# Altium schematic sheet Tri_Btate_Bank.SchDoc
size 762 x 381 mm
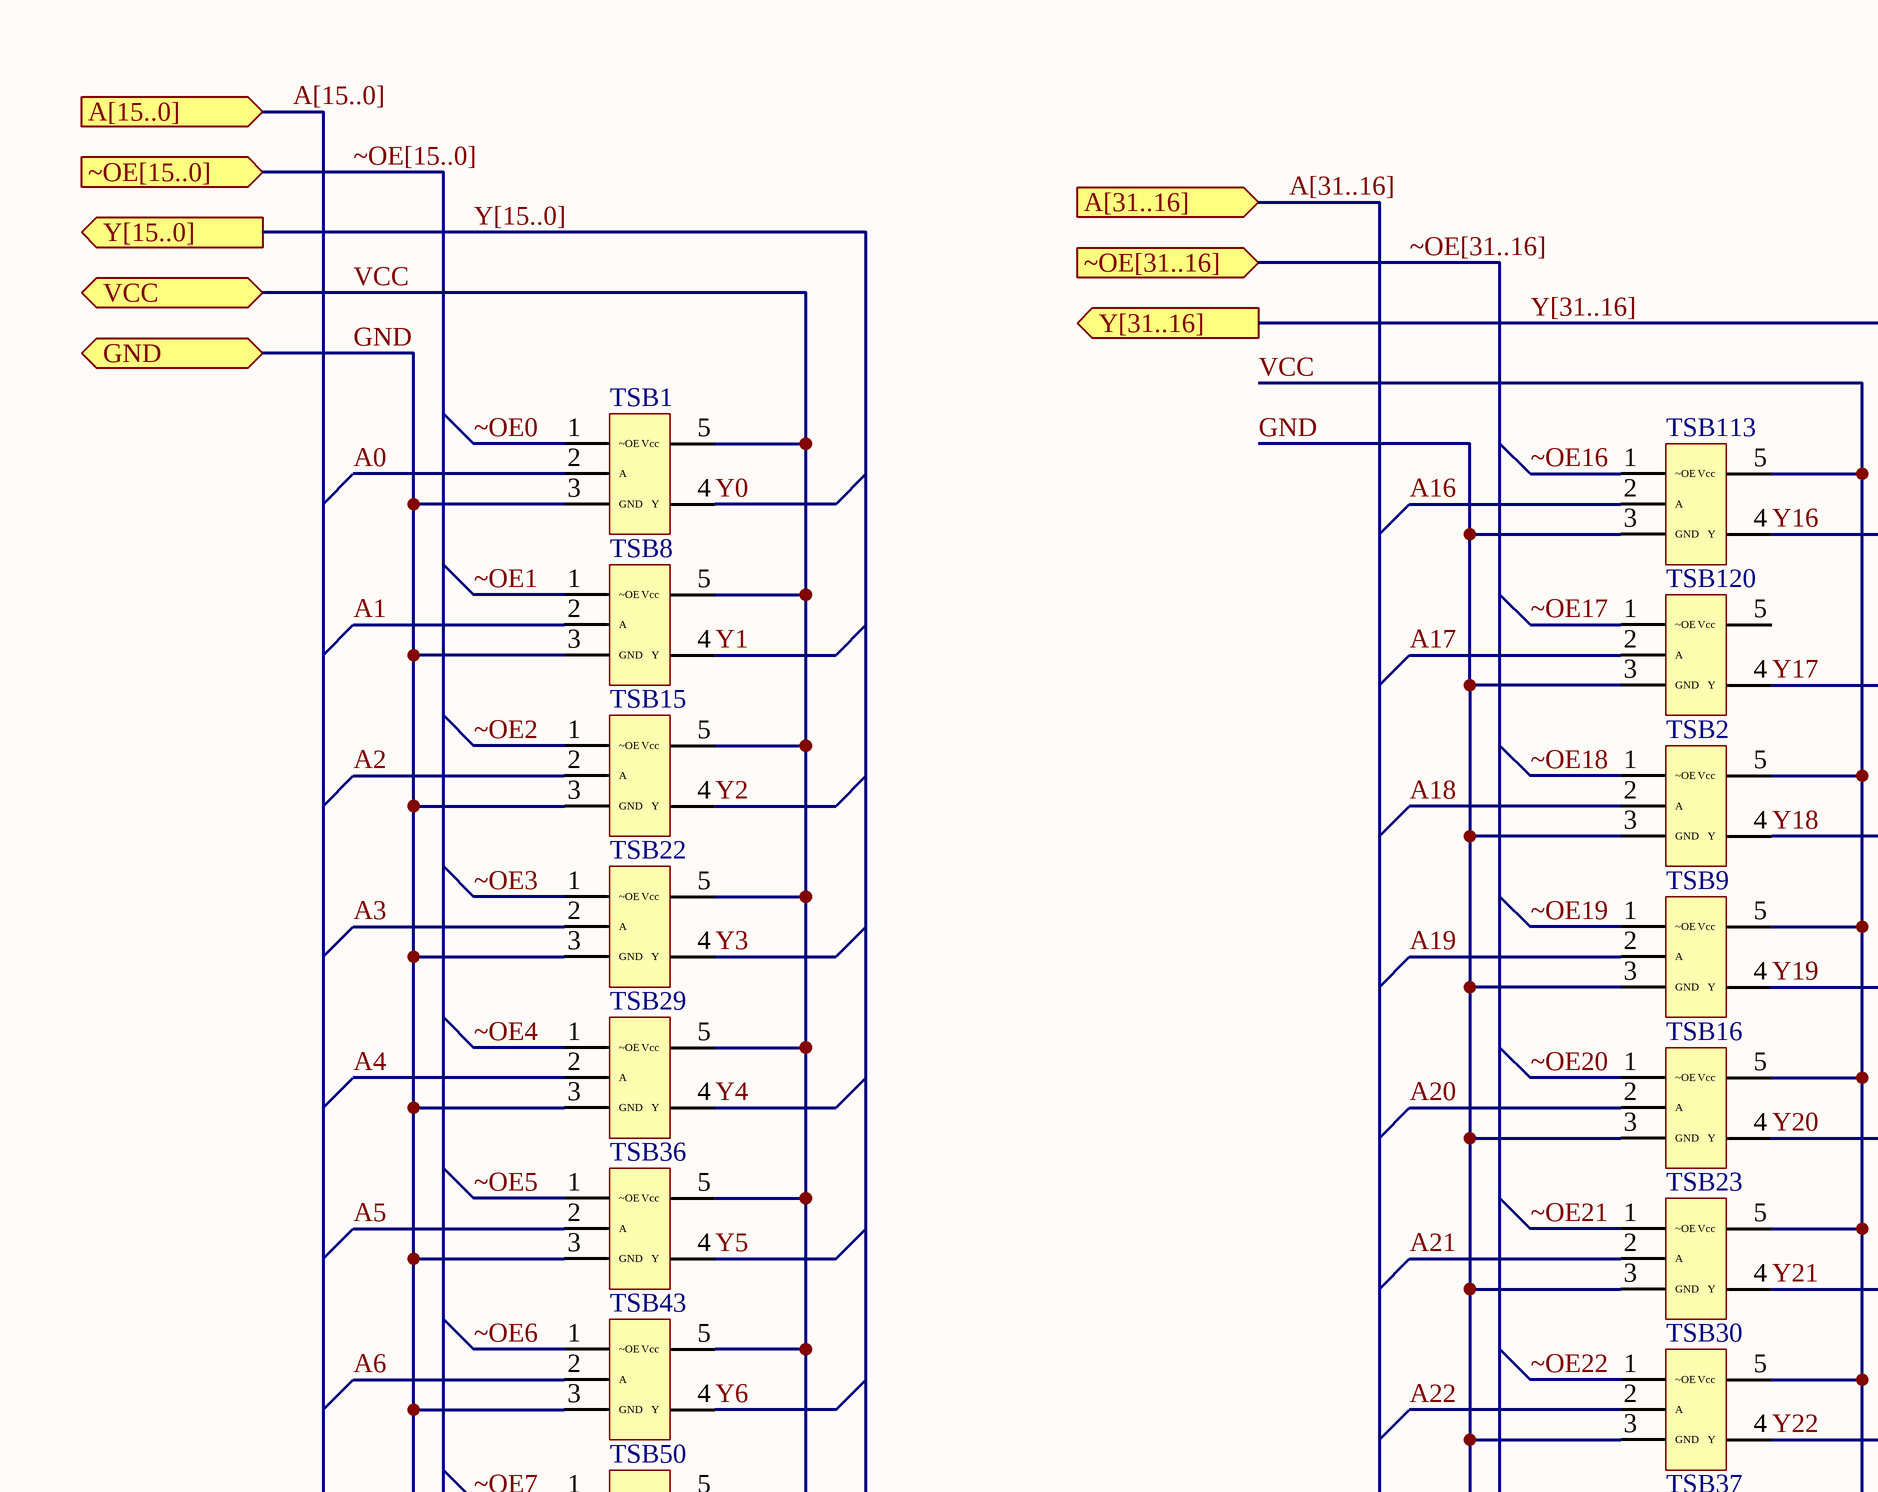
[diagram p0: Tri_Btate_Bank.SchDoc, top column 1 of 5]
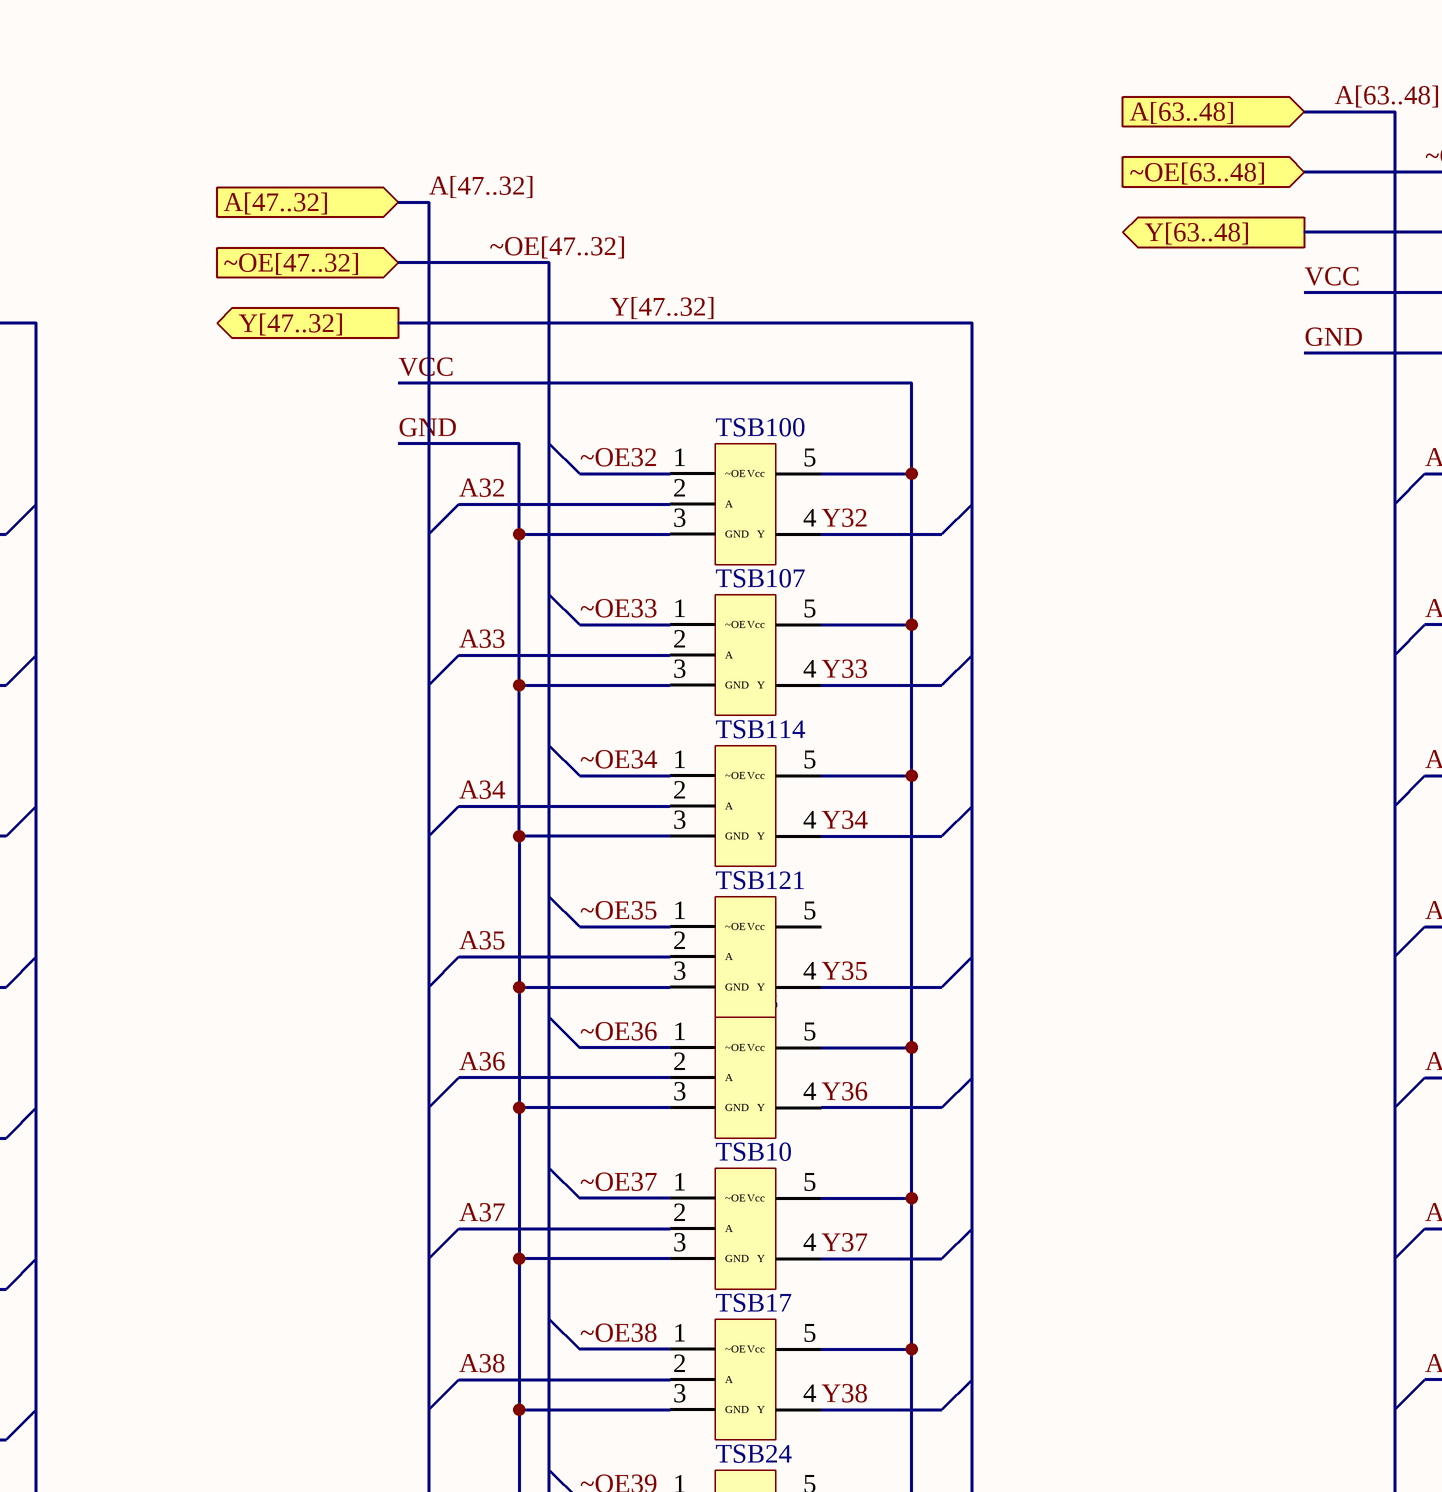
[diagram p1: Tri_Btate_Bank.SchDoc, top column 2 of 5]
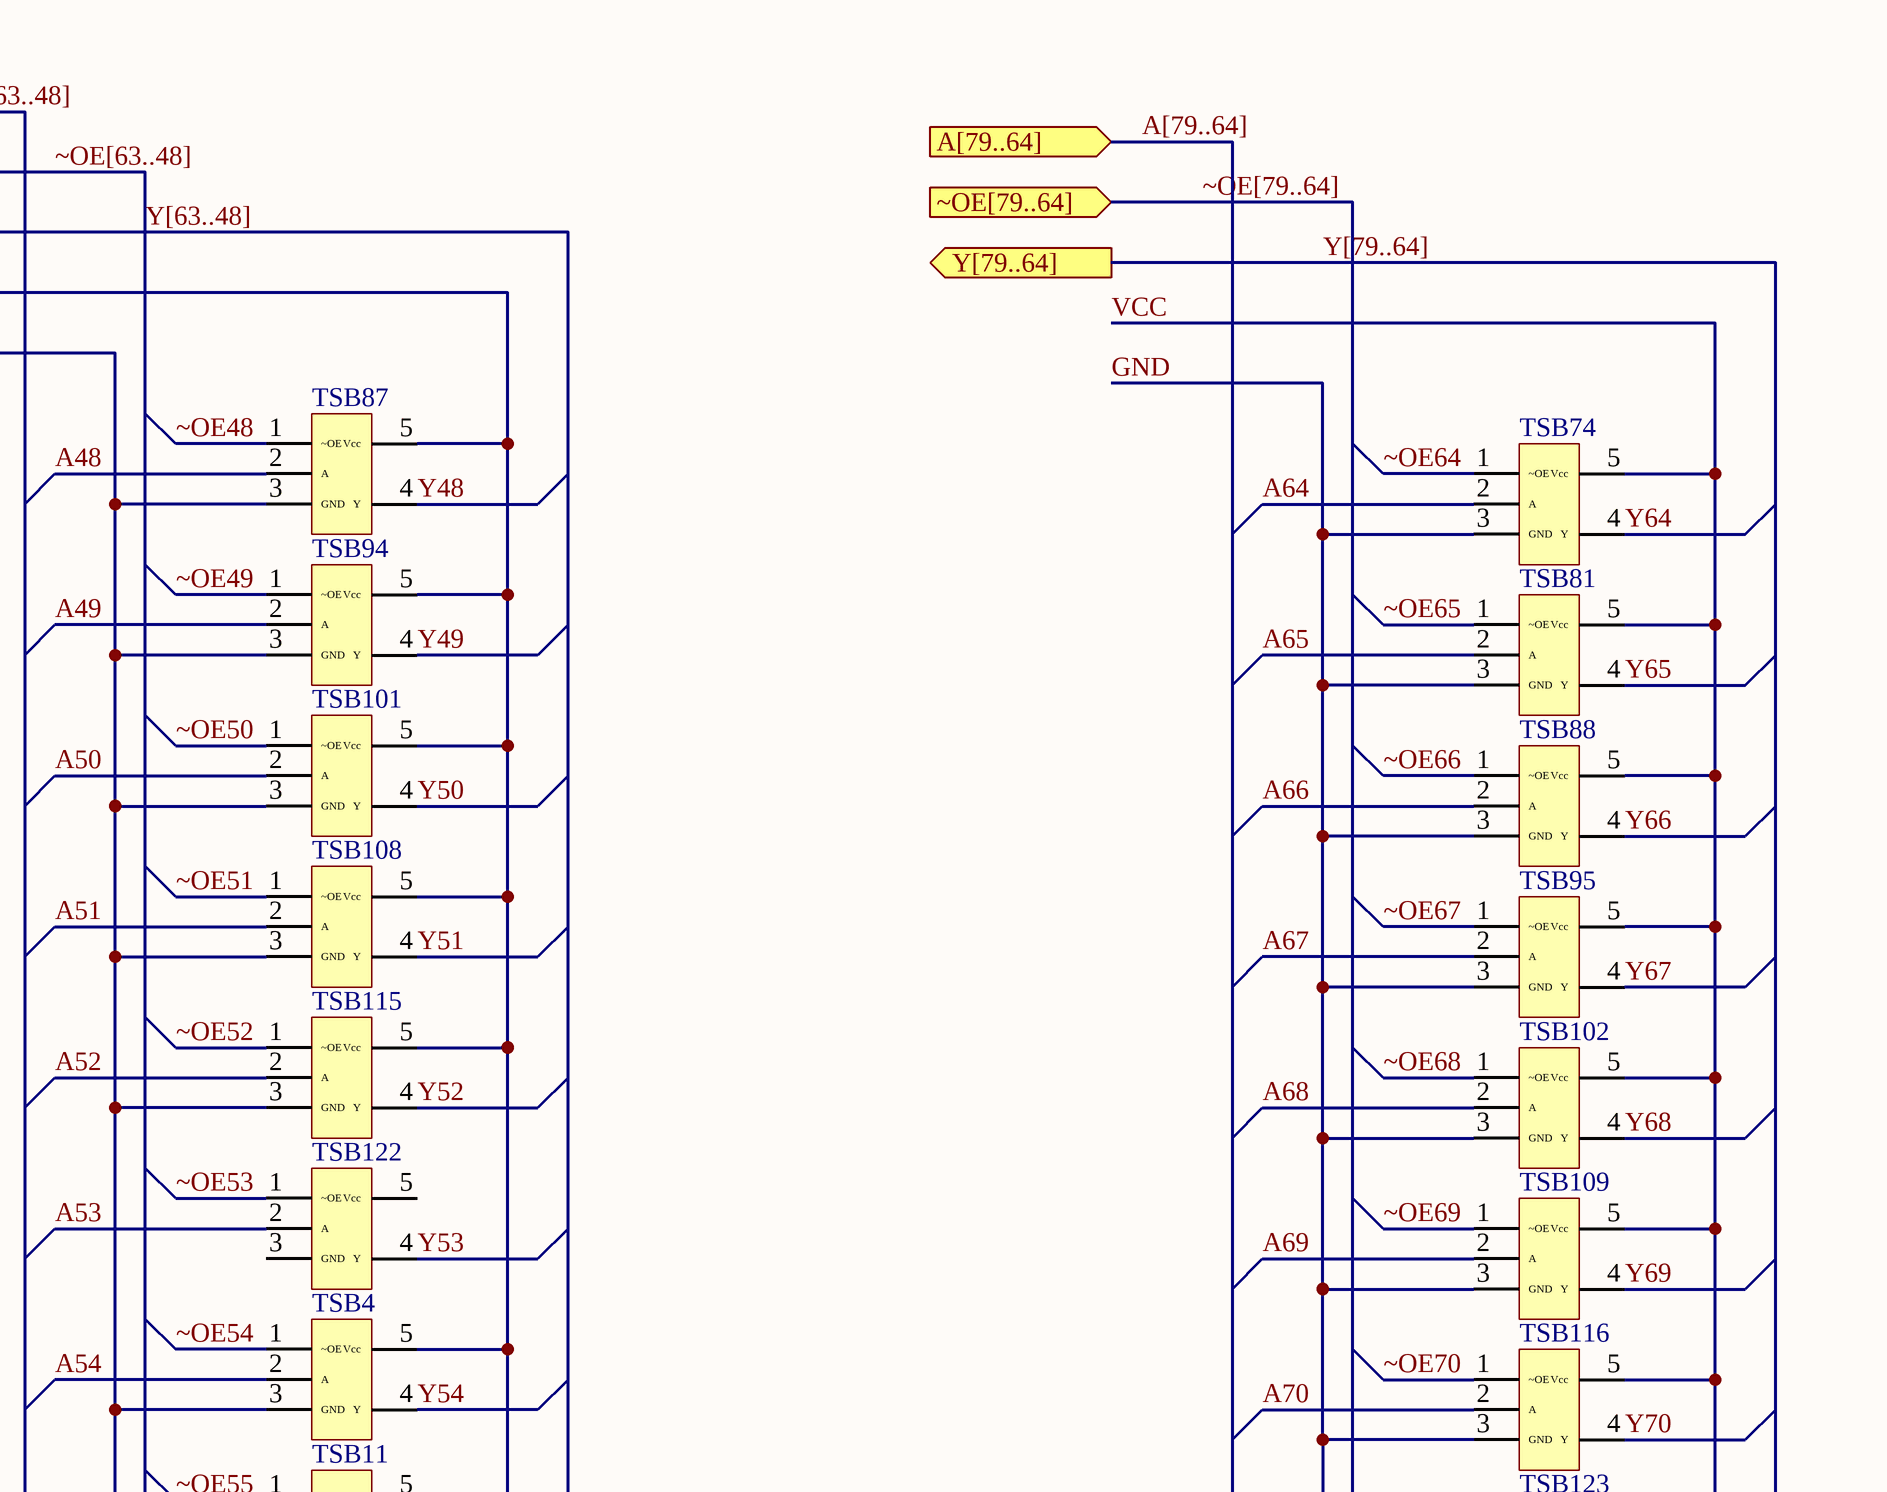
[diagram p2: Tri_Btate_Bank.SchDoc, top column 3 of 5]
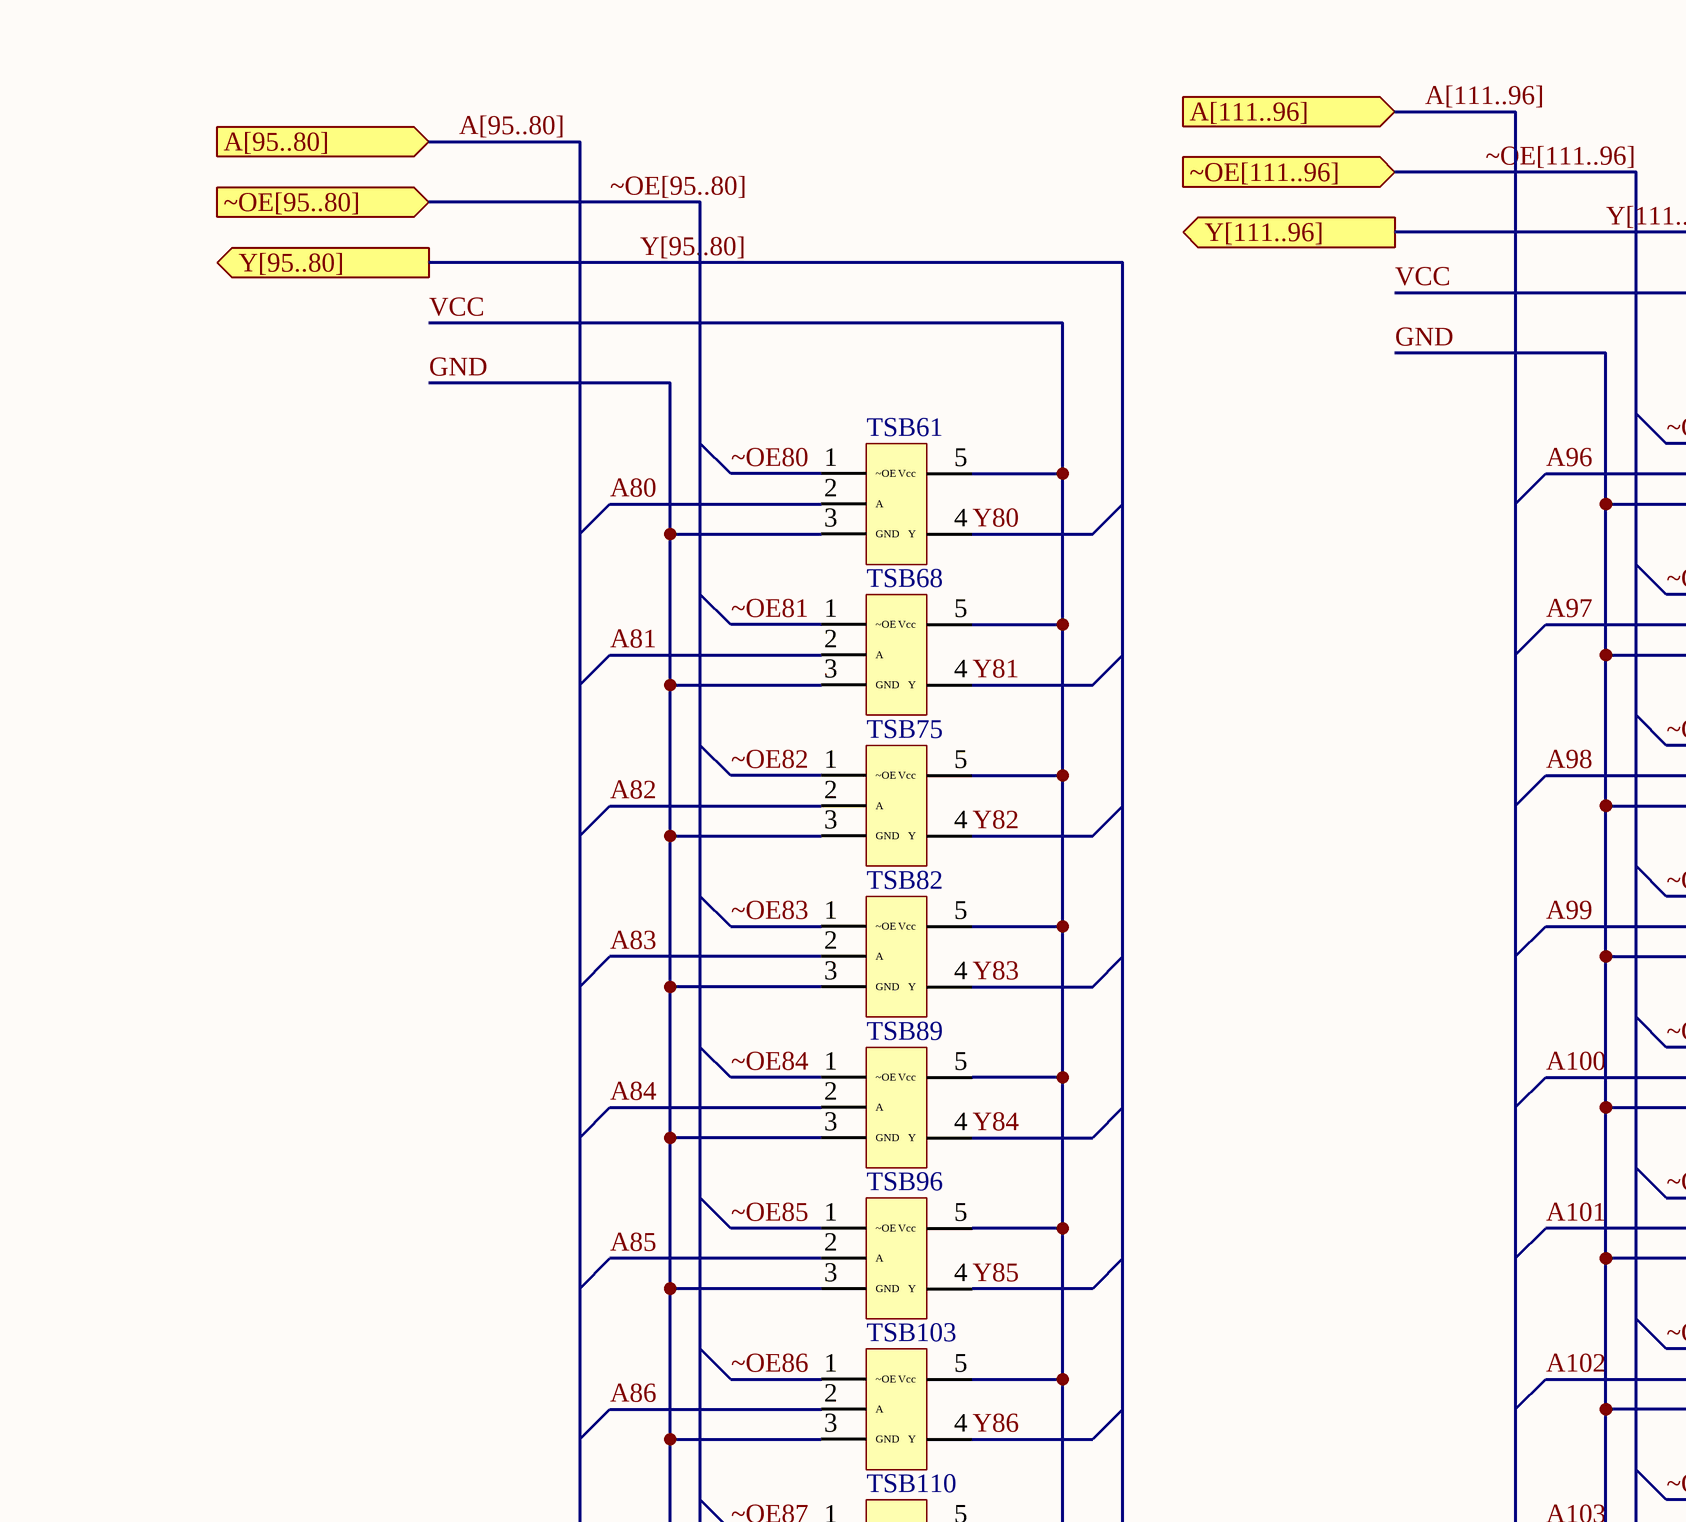
[diagram p3: Tri_Btate_Bank.SchDoc, top column 4 of 5]
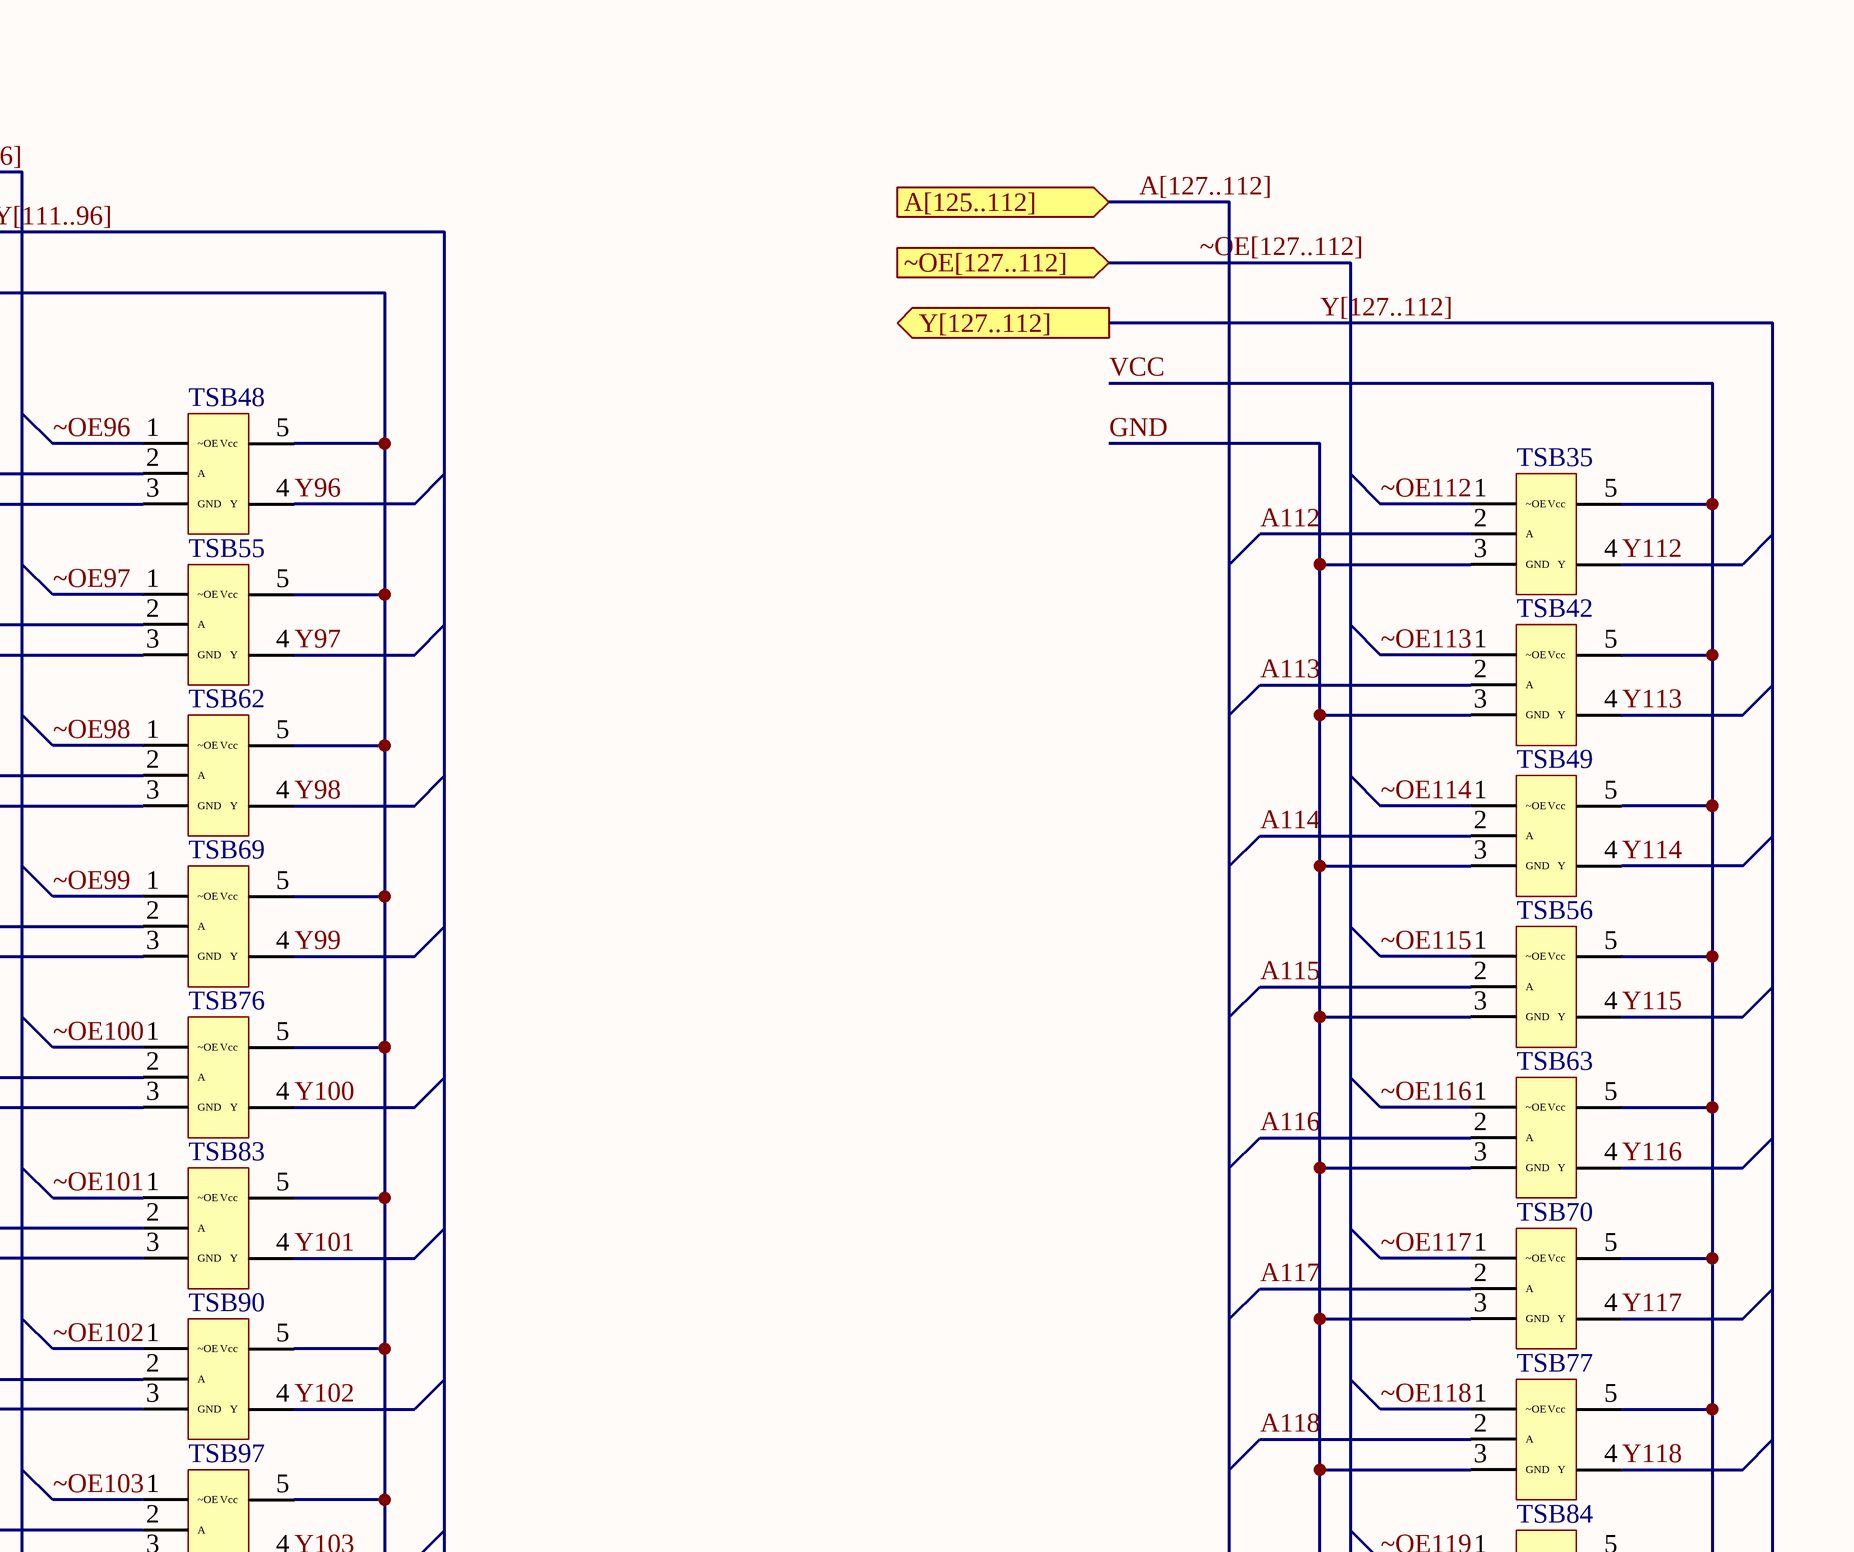
[diagram p4: Tri_Btate_Bank.SchDoc, top column 5 of 5]
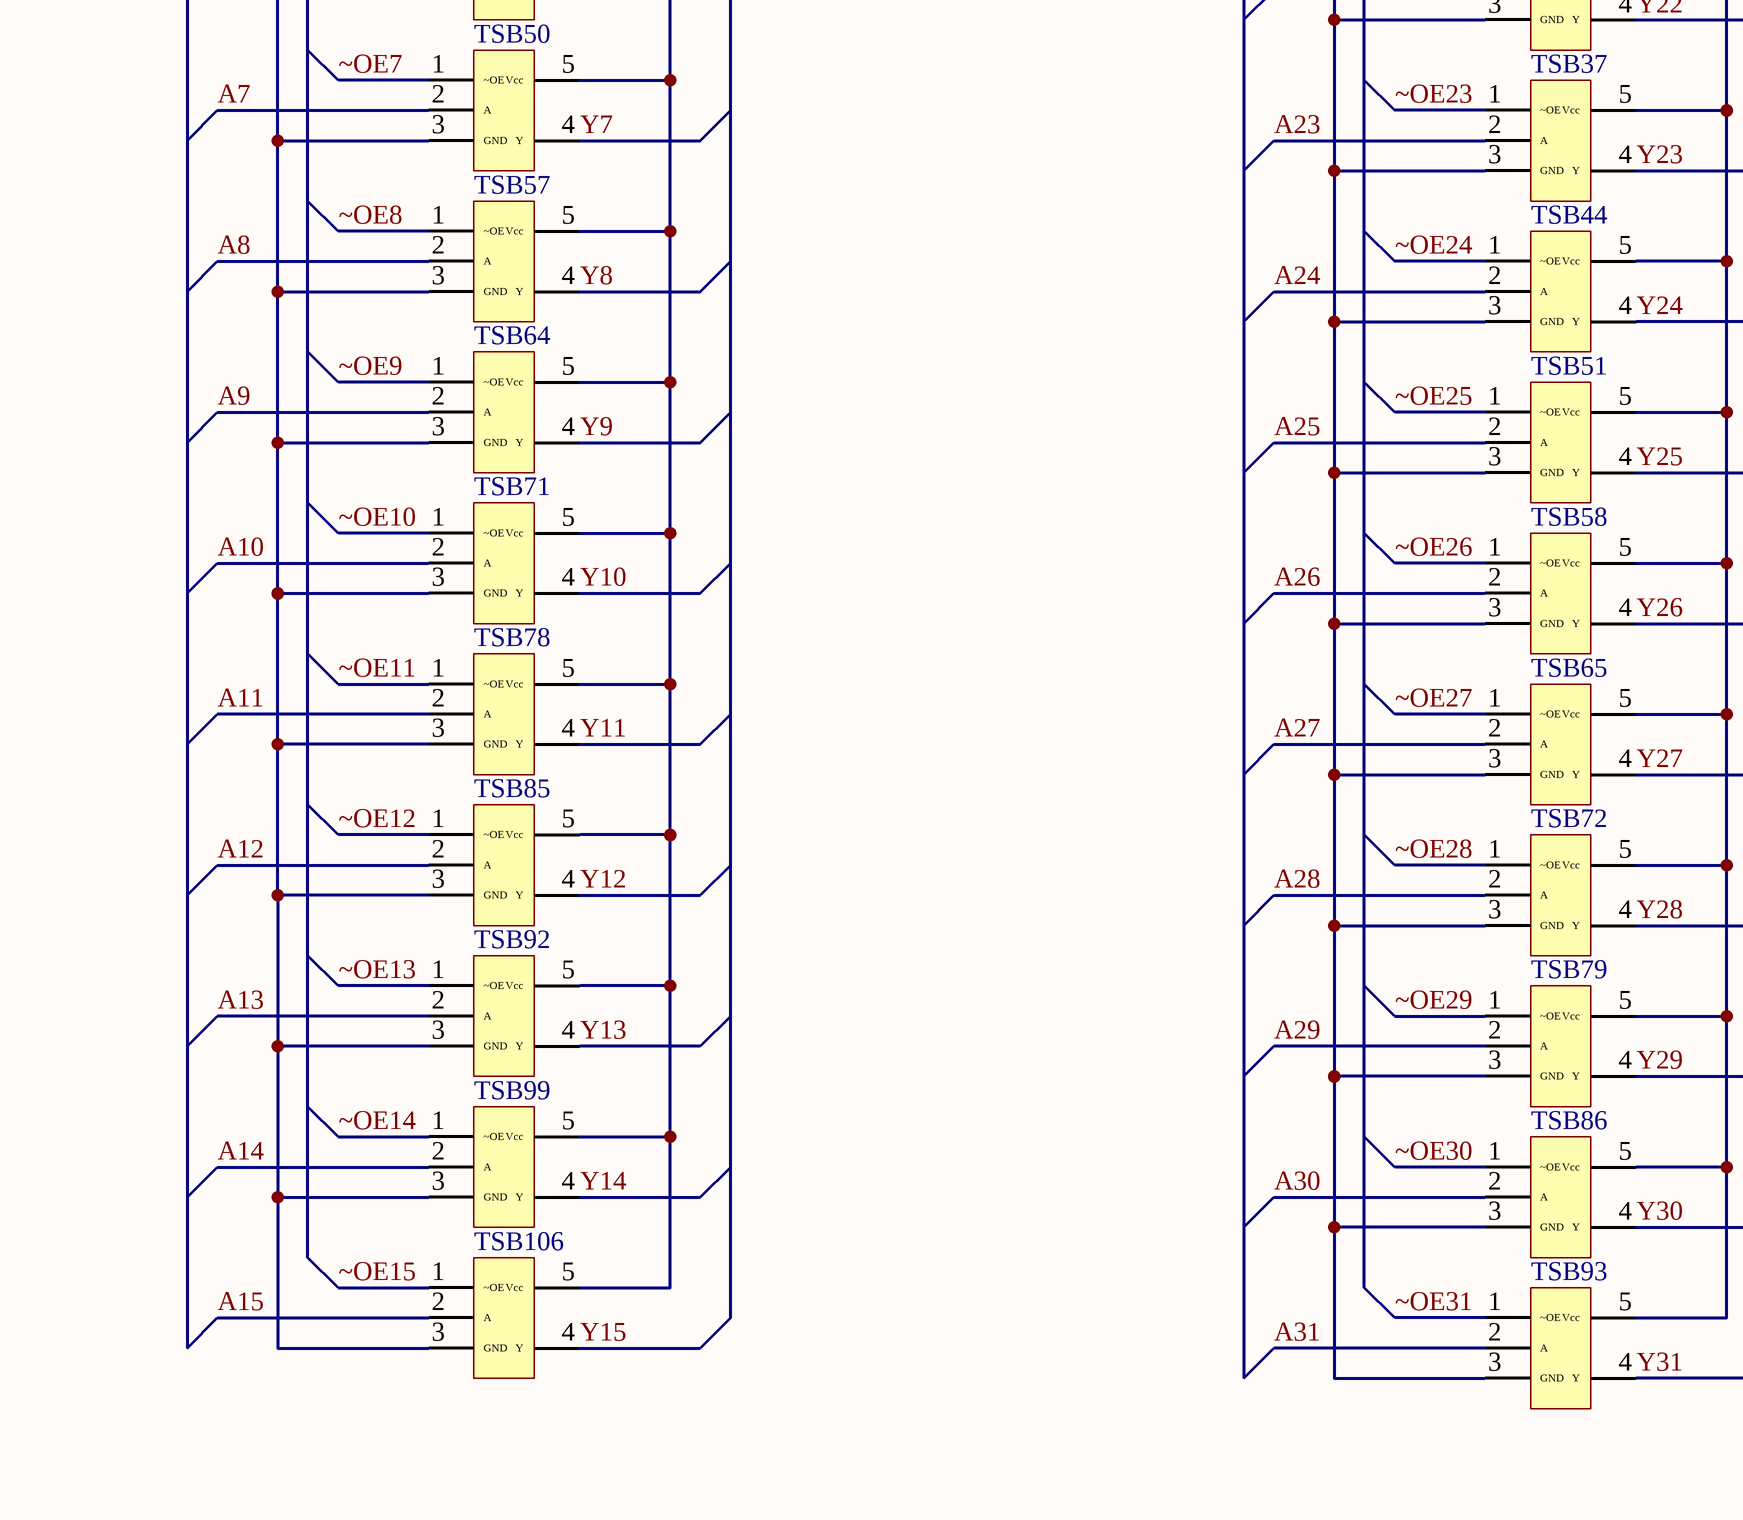
[diagram p5: Tri_Btate_Bank.SchDoc, bottom column 1 of 5]
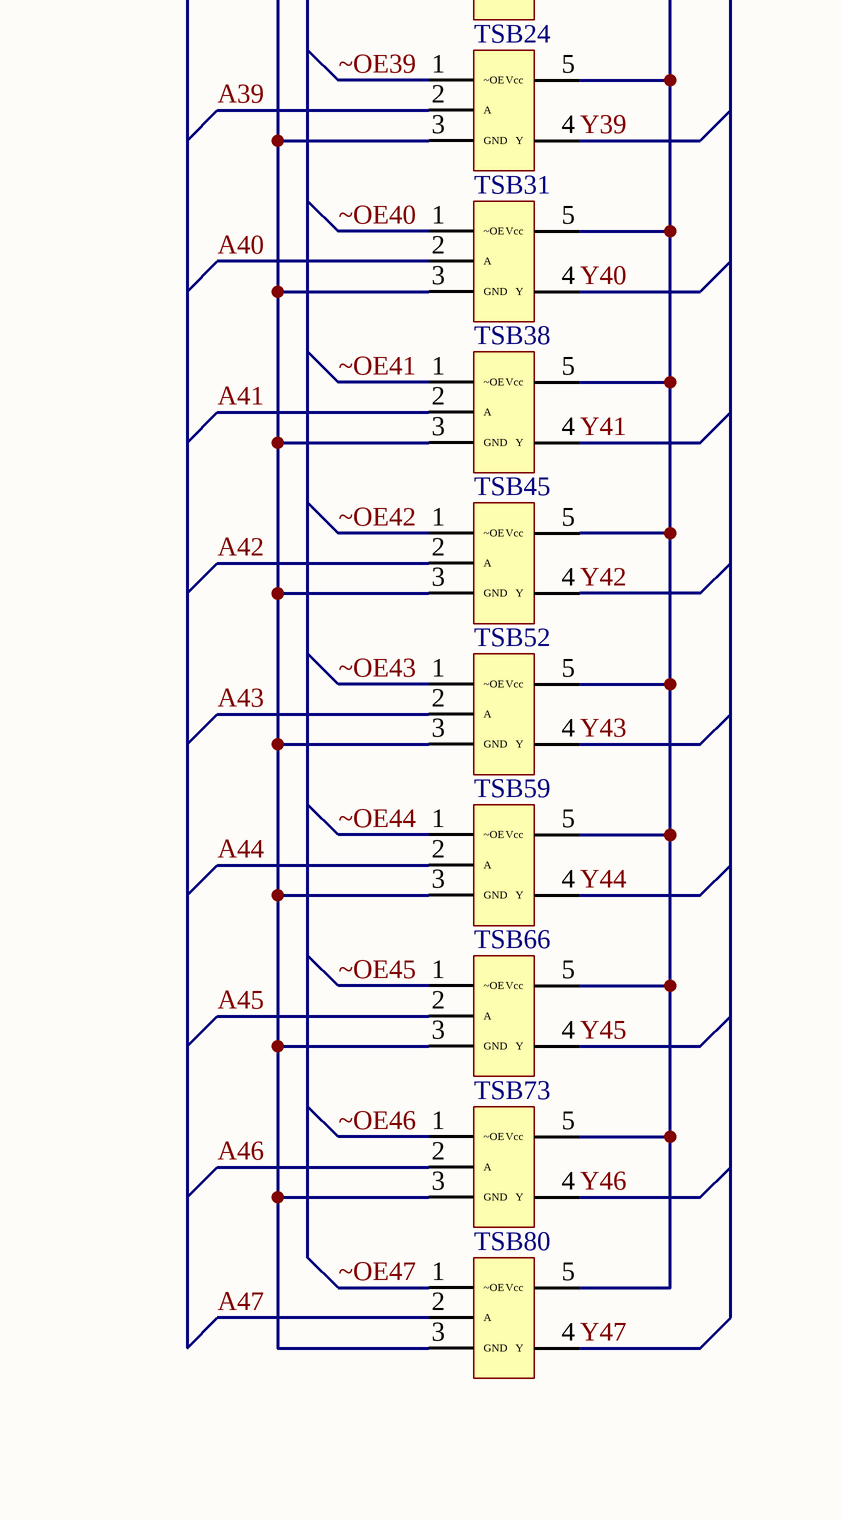
[diagram p6: Tri_Btate_Bank.SchDoc, bottom column 2 of 5]
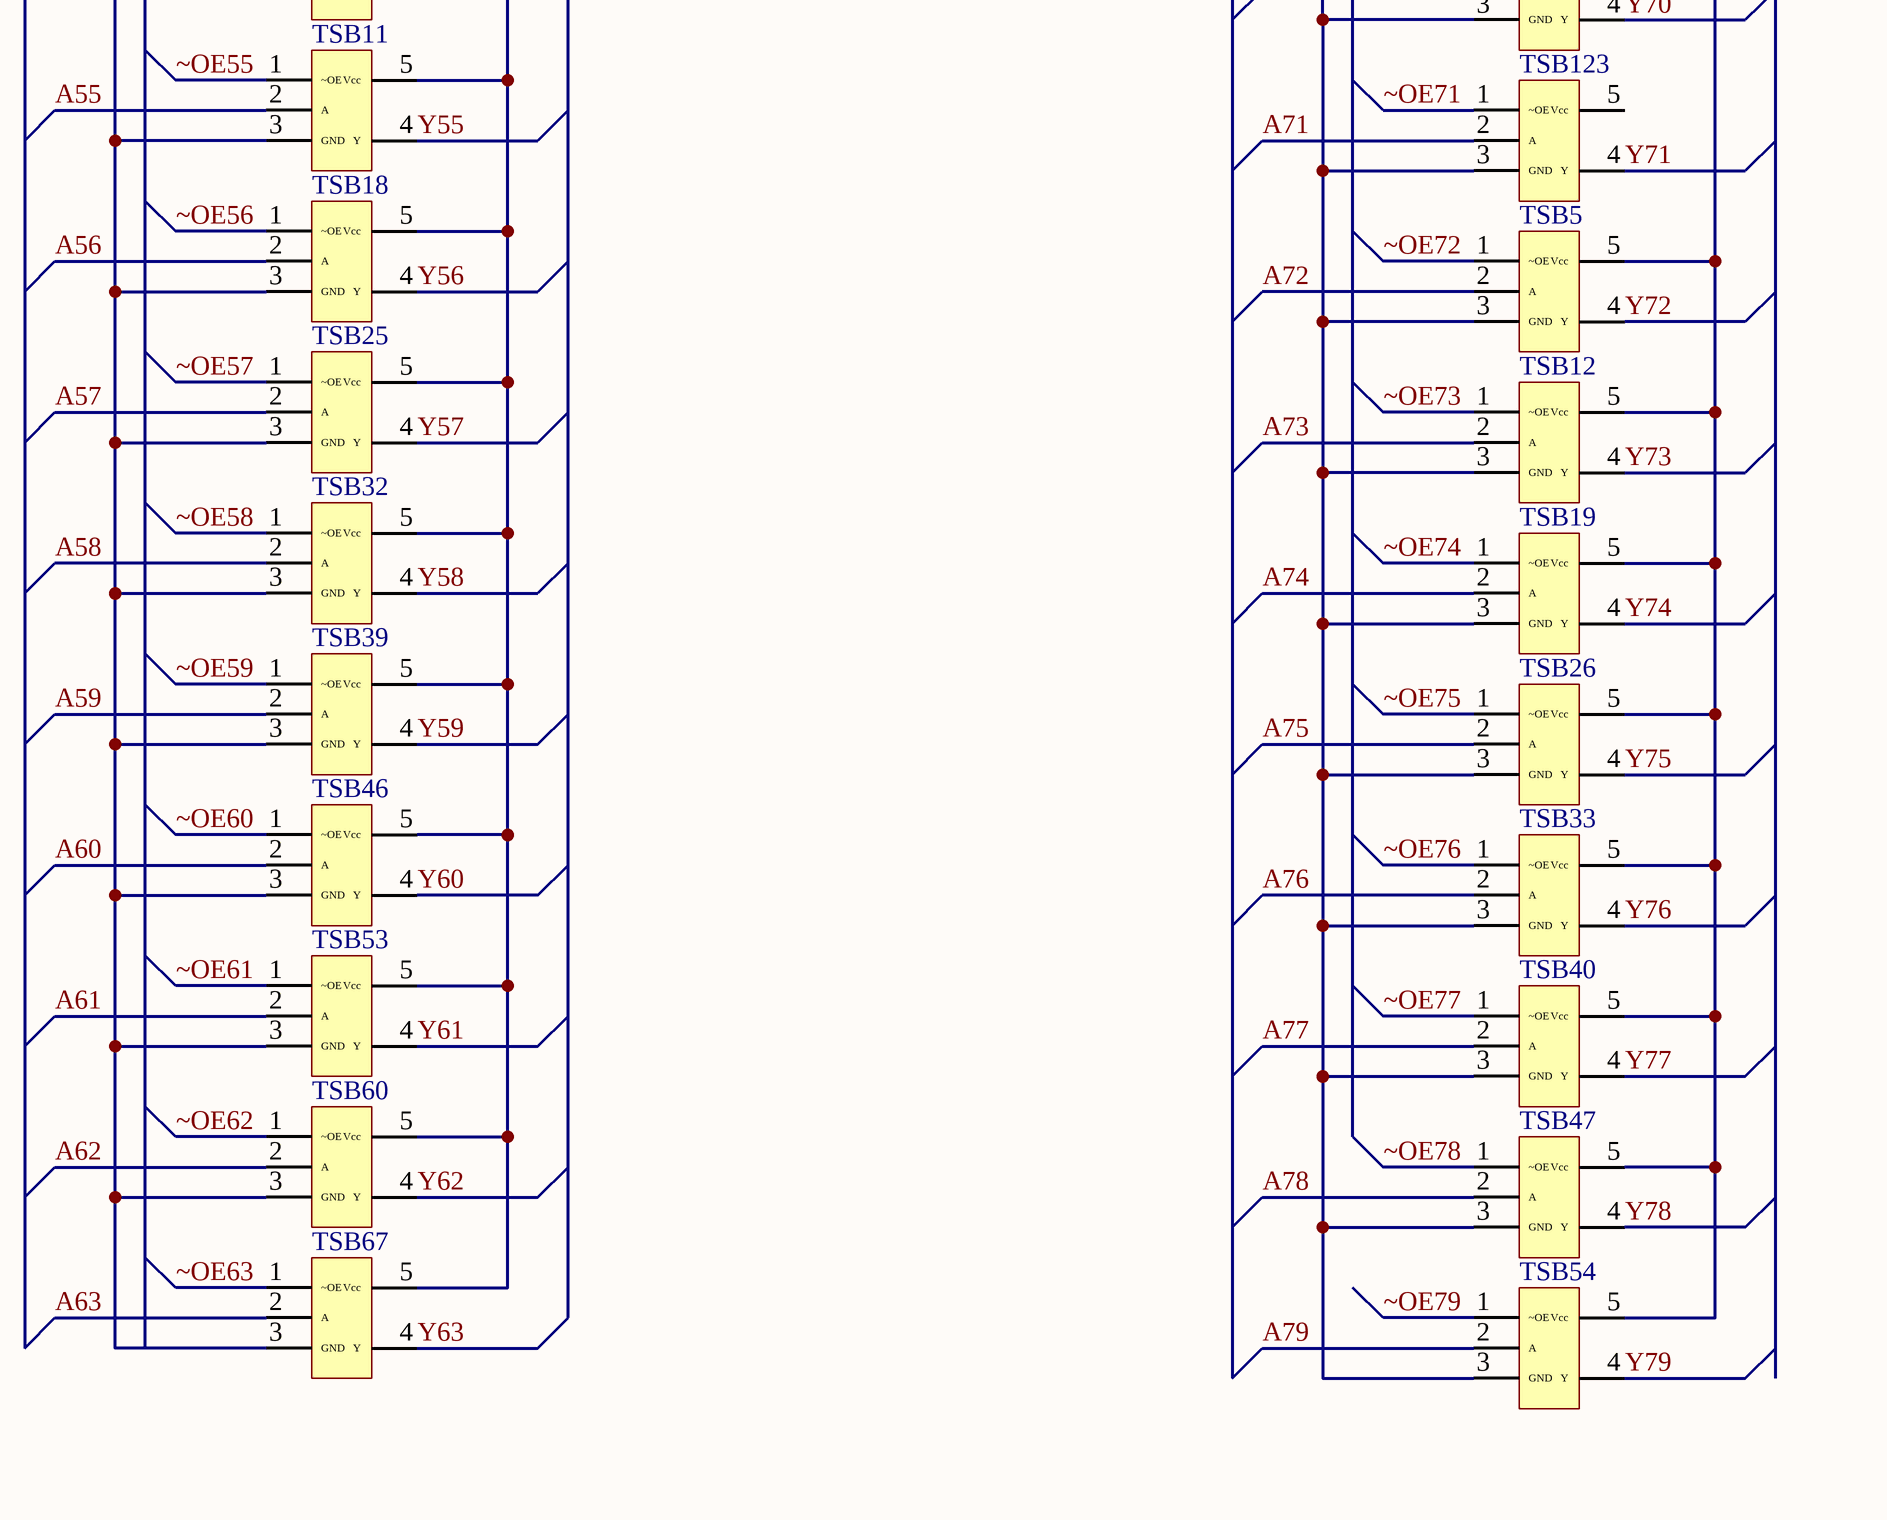
[diagram p7: Tri_Btate_Bank.SchDoc, bottom column 3 of 5]
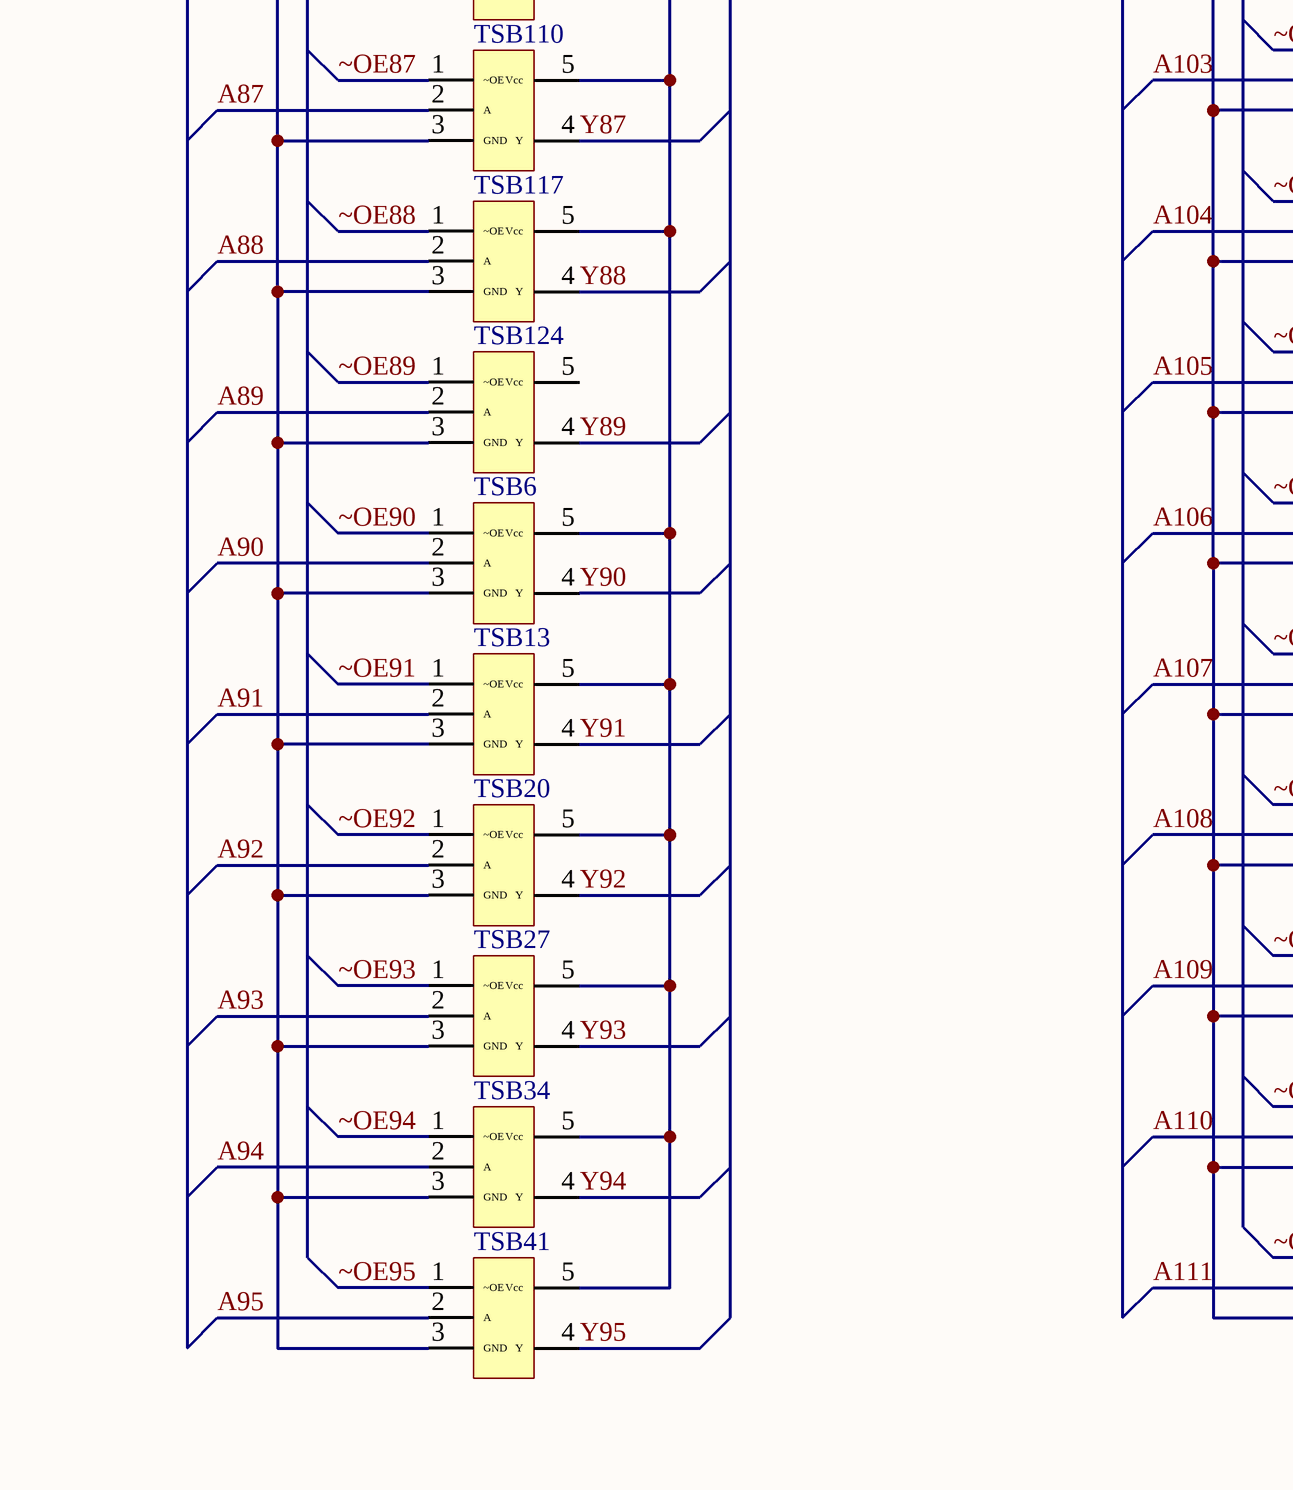
[diagram p8: Tri_Btate_Bank.SchDoc, bottom column 4 of 5]
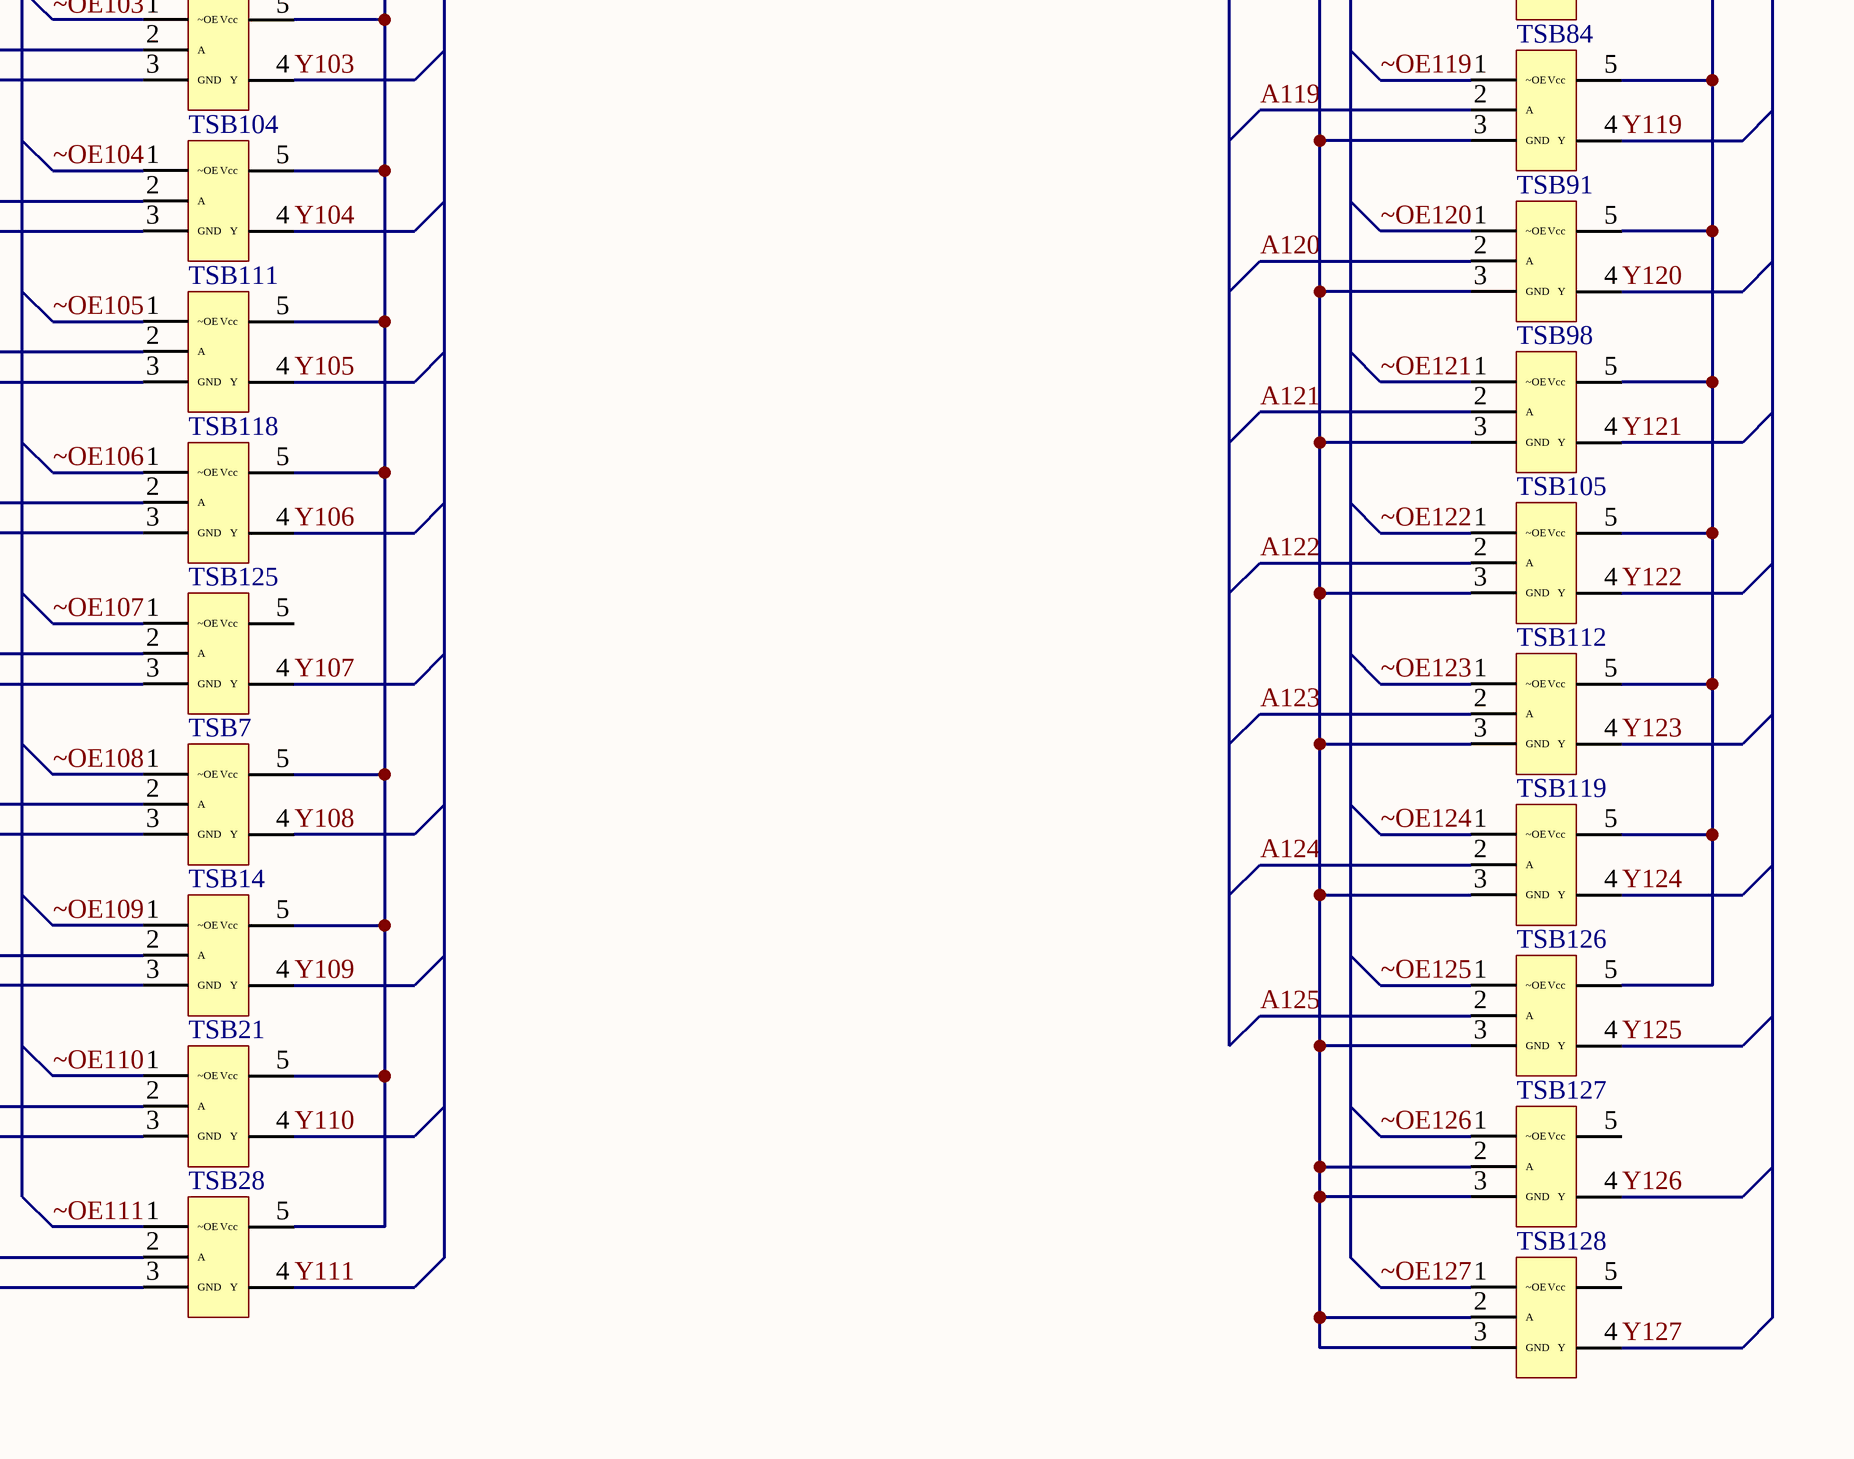
[diagram p9: Tri_Btate_Bank.SchDoc, bottom column 5 of 5]

## Parts
TSB1  Tri-State Buffer Non-Inverting  (value not drawn)
TSB2  Tri-State Buffer Non-Inverting  (value not drawn)
TSB3  Tri-State Buffer Non-Inverting  (value not drawn)
TSB4  Tri-State Buffer Non-Inverting  (value not drawn)
TSB5  Tri-State Buffer Non-Inverting  (value not drawn)
TSB6  Tri-State Buffer Non-Inverting  (value not drawn)
TSB7  Tri-State Buffer Non-Inverting  (value not drawn)
TSB8  Tri-State Buffer Non-Inverting  (value not drawn)
TSB9  Tri-State Buffer Non-Inverting  (value not drawn)
TSB10  Tri-State Buffer Non-Inverting  (value not drawn)
TSB11  Tri-State Buffer Non-Inverting  (value not drawn)
TSB12  Tri-State Buffer Non-Inverting  (value not drawn)
TSB13  Tri-State Buffer Non-Inverting  (value not drawn)
TSB14  Tri-State Buffer Non-Inverting  (value not drawn)
TSB15  Tri-State Buffer Non-Inverting  (value not drawn)
TSB16  Tri-State Buffer Non-Inverting  (value not drawn)
TSB17  Tri-State Buffer Non-Inverting  (value not drawn)
TSB18  Tri-State Buffer Non-Inverting  (value not drawn)
TSB19  Tri-State Buffer Non-Inverting  (value not drawn)
TSB20  Tri-State Buffer Non-Inverting  (value not drawn)
TSB21  Tri-State Buffer Non-Inverting  (value not drawn)
TSB22  Tri-State Buffer Non-Inverting  (value not drawn)
TSB23  Tri-State Buffer Non-Inverting  (value not drawn)
TSB24  Tri-State Buffer Non-Inverting  (value not drawn)
TSB25  Tri-State Buffer Non-Inverting  (value not drawn)
TSB26  Tri-State Buffer Non-Inverting  (value not drawn)
TSB27  Tri-State Buffer Non-Inverting  (value not drawn)
TSB28  Tri-State Buffer Non-Inverting  (value not drawn)
TSB29  Tri-State Buffer Non-Inverting  (value not drawn)
TSB30  Tri-State Buffer Non-Inverting  (value not drawn)
TSB31  Tri-State Buffer Non-Inverting  (value not drawn)
TSB32  Tri-State Buffer Non-Inverting  (value not drawn)
TSB33  Tri-State Buffer Non-Inverting  (value not drawn)
TSB34  Tri-State Buffer Non-Inverting  (value not drawn)
TSB35  Tri-State Buffer Non-Inverting  (value not drawn)
TSB36  Tri-State Buffer Non-Inverting  (value not drawn)
TSB37  Tri-State Buffer Non-Inverting  (value not drawn)
TSB38  Tri-State Buffer Non-Inverting  (value not drawn)
TSB39  Tri-State Buffer Non-Inverting  (value not drawn)
TSB40  Tri-State Buffer Non-Inverting  (value not drawn)
TSB41  Tri-State Buffer Non-Inverting  (value not drawn)
TSB42  Tri-State Buffer Non-Inverting  (value not drawn)
TSB43  Tri-State Buffer Non-Inverting  (value not drawn)
TSB44  Tri-State Buffer Non-Inverting  (value not drawn)
TSB45  Tri-State Buffer Non-Inverting  (value not drawn)
TSB46  Tri-State Buffer Non-Inverting  (value not drawn)
TSB47  Tri-State Buffer Non-Inverting  (value not drawn)
TSB48  Tri-State Buffer Non-Inverting  (value not drawn)
TSB49  Tri-State Buffer Non-Inverting  (value not drawn)
TSB50  Tri-State Buffer Non-Inverting  (value not drawn)
TSB51  Tri-State Buffer Non-Inverting  (value not drawn)
TSB52  Tri-State Buffer Non-Inverting  (value not drawn)
TSB53  Tri-State Buffer Non-Inverting  (value not drawn)
TSB54  Tri-State Buffer Non-Inverting  (value not drawn)
TSB55  Tri-State Buffer Non-Inverting  (value not drawn)
TSB56  Tri-State Buffer Non-Inverting  (value not drawn)
TSB57  Tri-State Buffer Non-Inverting  (value not drawn)
TSB58  Tri-State Buffer Non-Inverting  (value not drawn)
TSB59  Tri-State Buffer Non-Inverting  (value not drawn)
TSB60  Tri-State Buffer Non-Inverting  (value not drawn)
TSB61  Tri-State Buffer Non-Inverting  (value not drawn)
TSB62  Tri-State Buffer Non-Inverting  (value not drawn)
TSB63  Tri-State Buffer Non-Inverting  (value not drawn)
TSB64  Tri-State Buffer Non-Inverting  (value not drawn)
TSB65  Tri-State Buffer Non-Inverting  (value not drawn)
TSB66  Tri-State Buffer Non-Inverting  (value not drawn)
TSB67  Tri-State Buffer Non-Inverting  (value not drawn)
TSB68  Tri-State Buffer Non-Inverting  (value not drawn)
TSB69  Tri-State Buffer Non-Inverting  (value not drawn)
TSB70  Tri-State Buffer Non-Inverting  (value not drawn)
TSB71  Tri-State Buffer Non-Inverting  (value not drawn)
TSB72  Tri-State Buffer Non-Inverting  (value not drawn)
TSB73  Tri-State Buffer Non-Inverting  (value not drawn)
TSB74  Tri-State Buffer Non-Inverting  (value not drawn)
TSB75  Tri-State Buffer Non-Inverting  (value not drawn)
TSB76  Tri-State Buffer Non-Inverting  (value not drawn)
TSB77  Tri-State Buffer Non-Inverting  (value not drawn)
TSB78  Tri-State Buffer Non-Inverting  (value not drawn)
TSB79  Tri-State Buffer Non-Inverting  (value not drawn)
TSB80  Tri-State Buffer Non-Inverting  (value not drawn)
TSB81  Tri-State Buffer Non-Inverting  (value not drawn)
TSB82  Tri-State Buffer Non-Inverting  (value not drawn)
TSB83  Tri-State Buffer Non-Inverting  (value not drawn)
TSB84  Tri-State Buffer Non-Inverting  (value not drawn)
TSB85  Tri-State Buffer Non-Inverting  (value not drawn)
TSB86  Tri-State Buffer Non-Inverting  (value not drawn)
TSB87  Tri-State Buffer Non-Inverting  (value not drawn)
TSB88  Tri-State Buffer Non-Inverting  (value not drawn)
TSB89  Tri-State Buffer Non-Inverting  (value not drawn)
TSB90  Tri-State Buffer Non-Inverting  (value not drawn)
TSB91  Tri-State Buffer Non-Inverting  (value not drawn)
TSB92  Tri-State Buffer Non-Inverting  (value not drawn)
TSB93  Tri-State Buffer Non-Inverting  (value not drawn)
TSB94  Tri-State Buffer Non-Inverting  (value not drawn)
TSB95  Tri-State Buffer Non-Inverting  (value not drawn)
TSB96  Tri-State Buffer Non-Inverting  (value not drawn)
TSB97  Tri-State Buffer Non-Inverting  (value not drawn)
TSB98  Tri-State Buffer Non-Inverting  (value not drawn)
TSB99  Tri-State Buffer Non-Inverting  (value not drawn)
TSB100  Tri-State Buffer Non-Inverting  (value not drawn)
TSB101  Tri-State Buffer Non-Inverting  (value not drawn)
TSB102  Tri-State Buffer Non-Inverting  (value not drawn)
TSB103  Tri-State Buffer Non-Inverting  (value not drawn)
TSB104  Tri-State Buffer Non-Inverting  (value not drawn)
TSB105  Tri-State Buffer Non-Inverting  (value not drawn)
TSB106  Tri-State Buffer Non-Inverting  (value not drawn)
TSB107  Tri-State Buffer Non-Inverting  (value not drawn)
TSB108  Tri-State Buffer Non-Inverting  (value not drawn)
TSB109  Tri-State Buffer Non-Inverting  (value not drawn)
TSB110  Tri-State Buffer Non-Inverting  (value not drawn)
TSB111  Tri-State Buffer Non-Inverting  (value not drawn)
TSB112  Tri-State Buffer Non-Inverting  (value not drawn)
TSB113  Tri-State Buffer Non-Inverting  (value not drawn)
TSB114  Tri-State Buffer Non-Inverting  (value not drawn)
TSB115  Tri-State Buffer Non-Inverting  (value not drawn)
TSB116  Tri-State Buffer Non-Inverting  (value not drawn)
TSB117  Tri-State Buffer Non-Inverting  (value not drawn)
TSB118  Tri-State Buffer Non-Inverting  (value not drawn)
TSB119  Tri-State Buffer Non-Inverting  (value not drawn)
TSB120  Tri-State Buffer Non-Inverting  (value not drawn)
TSB121  Tri-State Buffer Non-Inverting  (value not drawn)
TSB122  Tri-State Buffer Non-Inverting  (value not drawn)
TSB123  Tri-State Buffer Non-Inverting  (value not drawn)
TSB124  Tri-State Buffer Non-Inverting  (value not drawn)
TSB125  Tri-State Buffer Non-Inverting  (value not drawn)
TSB126  Tri-State Buffer Non-Inverting  (value not drawn)
TSB127  Tri-State Buffer Non-Inverting  (value not drawn)
TSB128  Tri-State Buffer Non-Inverting  (value not drawn)

## Ports
A[15..0] (in), A[31..16] (in), A[47..32] (in), A[63..48] (in), A[79..64] (in), A[95..80] (in), A[111..96] (in), A[125..112] (in), GND (bidir), VCC (bidir), Y[15..0] (out), Y[31..16] (out), Y[47..32] (out), Y[63..48] (out), Y[79..64] (out), Y[95..80] (out), Y[111..96] (out), Y[127..112] (out), ~OE[15..0] (in), ~OE[31..16] (in), ~OE[47..32] (in), ~OE[63..48] (in), ~OE[79..64] (in), ~OE[95..80] (in), ~OE[111..96] (in), ~OE[127..112] (in)

## Nets
A0: TSB1.2(A)
A1: TSB8.2(A)
A2: TSB15.2(A)
A3: TSB22.2(A)
A4: TSB29.2(A)
A5: TSB36.2(A)
A6: TSB43.2(A)
A7: TSB50.2(A)
A8: TSB57.2(A)
A9: TSB64.2(A)
A10: TSB71.2(A)
A11: TSB78.2(A)
A12: TSB85.2(A)
A13: TSB92.2(A)
A14: TSB99.2(A)
A15: TSB106.2(A)
A16: TSB113.2(A)
A17: TSB120.2(A)
A18: TSB2.2(A)
A19: TSB9.2(A)
A20: TSB16.2(A)
A21: TSB23.2(A)
A22: TSB30.2(A)
A23: TSB37.2(A)
A24: TSB44.2(A)
A25: TSB51.2(A)
A26: TSB58.2(A)
A27: TSB65.2(A)
A28: TSB72.2(A)
A29: TSB79.2(A)
A30: TSB86.2(A)
A31: TSB93.2(A)
A32: TSB100.2(A)
A33: TSB107.2(A)
A34: TSB114.2(A)
A35: TSB121.2(A)
A36: TSB3.2(A)
A37: TSB10.2(A)
A38: TSB17.2(A)
A39: TSB24.2(A)
A40: TSB31.2(A)
A41: TSB38.2(A)
A42: TSB45.2(A)
A43: TSB52.2(A)
A44: TSB59.2(A)
A45: TSB66.2(A)
A46: TSB73.2(A)
A47: TSB80.2(A)
A48: TSB87.2(A)
A49: TSB94.2(A)
A50: TSB101.2(A)
A51: TSB108.2(A)
A52: TSB115.2(A)
A53: TSB122.2(A)
A54: TSB4.2(A)
A55: TSB11.2(A)
A56: TSB18.2(A)
A57: TSB25.2(A)
A58: TSB32.2(A)
A59: TSB39.2(A)
A60: TSB46.2(A)
A61: TSB53.2(A)
A62: TSB60.2(A)
A63: TSB67.2(A)
A64: TSB74.2(A)
A65: TSB81.2(A)
A66: TSB88.2(A)
A67: TSB95.2(A)
A68: TSB102.2(A)
A69: TSB109.2(A)
A70: TSB116.2(A)
A71: TSB123.2(A)
A72: TSB5.2(A)
A73: TSB12.2(A)
A74: TSB19.2(A)
A75: TSB26.2(A)
A76: TSB33.2(A)
A77: TSB40.2(A)
A78: TSB47.2(A)
A79: TSB54.2(A)
A80: TSB61.2(A)
A81: TSB68.2(A)
A82: TSB75.2(A)
A83: TSB82.2(A)
A84: TSB89.2(A)
A85: TSB96.2(A)
A86: TSB103.2(A)
A87: TSB110.2(A)
A88: TSB117.2(A)
A89: TSB124.2(A)
A90: TSB6.2(A)
A91: TSB13.2(A)
A92: TSB20.2(A)
A93: TSB27.2(A)
A94: TSB34.2(A)
A95: TSB41.2(A)
A96: TSB48.2(A)
A97: TSB55.2(A)
A98: TSB62.2(A)
A99: TSB69.2(A)
A100: TSB76.2(A)
A101: TSB83.2(A)
A102: TSB90.2(A)
A103: TSB97.2(A)
A104: TSB104.2(A)
A105: TSB111.2(A)
A106: TSB118.2(A)
A107: TSB125.2(A)
A108: TSB7.2(A)
A109: TSB14.2(A)
A110: TSB21.2(A)
A111: TSB28.2(A)
A112: TSB35.2(A)
A113: TSB42.2(A)
A114: TSB49.2(A)
A115: TSB56.2(A)
A116: TSB63.2(A)
A117: TSB70.2(A)
A118: TSB77.2(A)
A119: TSB84.2(A)
A120: TSB91.2(A)
A121: TSB98.2(A)
A122: TSB105.2(A)
A123: TSB112.2(A)
A124: TSB119.2(A)
A125: TSB126.2(A)
GND: TSB1.3(GND) TSB2.3(GND) TSB3.3(GND) TSB4.3(GND) TSB5.3(GND) TSB6.3(GND) TSB7.3(GND) TSB8.3(GND) TSB9.3(GND) TSB10.3(GND) TSB11.3(GND) TSB12.3(GND) TSB13.3(GND) TSB14.3(GND) TSB15.3(GND) TSB16.3(GND) TSB17.3(GND) TSB18.3(GND) TSB19.3(GND) TSB20.3(GND) TSB21.3(GND) TSB22.3(GND) TSB23.3(GND) TSB24.3(GND) TSB25.3(GND) TSB26.3(GND) TSB27.3(GND) TSB28.3(GND) TSB29.3(GND) TSB30.3(GND) TSB31.3(GND) TSB32.3(GND) TSB33.3(GND) TSB34.3(GND) TSB35.3(GND) TSB36.3(GND) TSB37.3(GND) TSB38.3(GND) TSB39.3(GND) TSB40.3(GND) TSB41.3(GND) TSB42.3(GND) TSB43.3(GND) TSB44.3(GND) TSB45.3(GND) TSB46.3(GND) TSB47.3(GND) TSB48.3(GND) TSB49.3(GND) TSB50.3(GND) TSB51.3(GND) TSB52.3(GND) TSB53.3(GND) TSB54.3(GND) TSB55.3(GND) TSB56.3(GND) TSB57.3(GND) TSB58.3(GND) TSB59.3(GND) TSB60.3(GND) TSB61.3(GND) TSB62.3(GND) TSB63.3(GND) TSB64.3(GND) TSB65.3(GND) TSB66.3(GND) TSB67.3(GND) TSB68.3(GND) TSB69.3(GND) TSB70.3(GND) TSB71.3(GND) TSB72.3(GND) TSB73.3(GND) TSB74.3(GND) TSB75.3(GND) TSB76.3(GND) TSB77.3(GND) TSB78.3(GND) TSB79.3(GND) TSB80.3(GND) TSB81.3(GND) TSB82.3(GND) TSB83.3(GND) TSB84.3(GND) TSB85.3(GND) TSB86.3(GND) TSB87.3(GND) TSB88.3(GND) TSB89.3(GND) TSB90.3(GND) TSB91.3(GND) TSB92.3(GND) TSB93.3(GND) TSB94.3(GND) TSB95.3(GND) TSB96.3(GND) TSB97.3(GND) TSB98.3(GND) TSB99.3(GND) TSB100.3(GND) TSB101.3(GND) TSB102.3(GND) TSB103.3(GND) TSB104.3(GND) TSB105.3(GND) TSB106.3(GND) TSB107.3(GND) TSB108.3(GND) TSB109.3(GND) TSB110.3(GND) TSB111.3(GND) TSB112.3(GND) TSB113.3(GND) TSB114.3(GND) TSB115.3(GND) TSB116.3(GND) TSB117.3(GND) TSB118.3(GND) TSB119.3(GND) TSB120.3(GND) TSB121.3(GND) TSB123.3(GND) TSB124.3(GND) TSB125.3(GND) TSB126.3(GND) TSB127.2(A) TSB127.3(GND) TSB128.2(A) TSB128.3(GND) ; port GND
VCC: TSB1.5(Vcc) TSB2.5(Vcc) TSB3.5(Vcc) TSB4.5(Vcc) TSB5.5(Vcc) TSB6.5(Vcc) TSB7.5(Vcc) TSB8.5(Vcc) TSB9.5(Vcc) TSB10.5(Vcc) TSB11.5(Vcc) TSB12.5(Vcc) TSB13.5(Vcc) TSB14.5(Vcc) TSB15.5(Vcc) TSB16.5(Vcc) TSB17.5(Vcc) TSB18.5(Vcc) TSB19.5(Vcc) TSB20.5(Vcc) TSB21.5(Vcc) TSB22.5(Vcc) TSB23.5(Vcc) TSB24.5(Vcc) TSB25.5(Vcc) TSB26.5(Vcc) TSB27.5(Vcc) TSB28.5(Vcc) TSB29.5(Vcc) TSB30.5(Vcc) TSB31.5(Vcc) TSB32.5(Vcc) TSB33.5(Vcc) TSB34.5(Vcc) TSB35.5(Vcc) TSB36.5(Vcc) TSB37.5(Vcc) TSB38.5(Vcc) TSB39.5(Vcc) TSB40.5(Vcc) TSB41.5(Vcc) TSB42.5(Vcc) TSB43.5(Vcc) TSB44.5(Vcc) TSB45.5(Vcc) TSB46.5(Vcc) TSB47.5(Vcc) TSB48.5(Vcc) TSB49.5(Vcc) TSB50.5(Vcc) TSB51.5(Vcc) TSB52.5(Vcc) TSB53.5(Vcc) TSB54.5(Vcc) TSB55.5(Vcc) TSB56.5(Vcc) TSB57.5(Vcc) TSB58.5(Vcc) TSB59.5(Vcc) TSB60.5(Vcc) TSB61.5(Vcc) TSB62.5(Vcc) TSB63.5(Vcc) TSB64.5(Vcc) TSB65.5(Vcc) TSB66.5(Vcc) TSB67.5(Vcc) TSB68.5(Vcc) TSB69.5(Vcc) TSB70.5(Vcc) TSB71.5(Vcc) TSB72.5(Vcc) TSB73.5(Vcc) TSB74.5(Vcc) TSB75.5(Vcc) TSB76.5(Vcc) TSB77.5(Vcc) TSB78.5(Vcc) TSB79.5(Vcc) TSB80.5(Vcc) TSB81.5(Vcc) TSB82.5(Vcc) TSB83.5(Vcc) TSB84.5(Vcc) TSB85.5(Vcc) TSB86.5(Vcc) TSB87.5(Vcc) TSB88.5(Vcc) TSB89.5(Vcc) TSB90.5(Vcc) TSB91.5(Vcc) TSB92.5(Vcc) TSB93.5(Vcc) TSB94.5(Vcc) TSB95.5(Vcc) TSB96.5(Vcc) TSB97.5(Vcc) TSB98.5(Vcc) TSB99.5(Vcc) TSB100.5(Vcc) TSB101.5(Vcc) TSB102.5(Vcc) TSB103.5(Vcc) TSB104.5(Vcc) TSB105.5(Vcc) TSB106.5(Vcc) TSB107.5(Vcc) TSB108.5(Vcc) TSB109.5(Vcc) TSB110.5(Vcc) TSB111.5(Vcc) TSB112.5(Vcc) TSB113.5(Vcc) TSB114.5(Vcc) TSB115.5(Vcc) TSB116.5(Vcc) TSB117.5(Vcc) TSB118.5(Vcc) TSB119.5(Vcc) TSB126.5(Vcc) ; port VCC
Y0: TSB1.4(Y)
Y1: TSB8.4(Y)
Y2: TSB15.4(Y)
Y3: TSB22.4(Y)
Y4: TSB29.4(Y)
Y5: TSB36.4(Y)
Y6: TSB43.4(Y)
Y7: TSB50.4(Y)
Y8: TSB57.4(Y)
Y9: TSB64.4(Y)
Y10: TSB71.4(Y)
Y11: TSB78.4(Y)
Y12: TSB85.4(Y)
Y13: TSB92.4(Y)
Y14: TSB99.4(Y)
Y15: TSB106.4(Y)
Y16: TSB113.4(Y)
Y17: TSB120.4(Y)
Y18: TSB2.4(Y)
Y19: TSB9.4(Y)
Y20: TSB16.4(Y)
Y21: TSB23.4(Y)
Y22: TSB30.4(Y)
Y23: TSB37.4(Y)
Y24: TSB44.4(Y)
Y25: TSB51.4(Y)
Y26: TSB58.4(Y)
Y27: TSB65.4(Y)
Y28: TSB72.4(Y)
Y29: TSB79.4(Y)
Y30: TSB86.4(Y)
Y31: TSB93.4(Y)
Y32: TSB100.4(Y)
Y33: TSB107.4(Y)
Y34: TSB114.4(Y)
Y35: TSB121.4(Y)
Y36: TSB3.4(Y)
Y37: TSB10.4(Y)
Y38: TSB17.4(Y)
Y39: TSB24.4(Y)
Y40: TSB31.4(Y)
Y41: TSB38.4(Y)
Y42: TSB45.4(Y)
Y43: TSB52.4(Y)
Y44: TSB59.4(Y)
Y45: TSB66.4(Y)
Y46: TSB73.4(Y)
Y47: TSB80.4(Y)
Y48: TSB87.1(~OE) TSB87.4(Y)  [also labelled ~OE48]
Y49: TSB94.1(~OE) TSB94.4(Y)  [also labelled ~OE49]
Y50: TSB101.1(~OE) TSB101.4(Y)  [also labelled ~OE50]
Y51: TSB108.1(~OE) TSB108.4(Y)  [also labelled ~OE51]
Y52: TSB115.1(~OE) TSB115.4(Y)  [also labelled ~OE52]
Y53: TSB122.1(~OE) TSB122.4(Y)  [also labelled ~OE53]
Y54: TSB4.1(~OE) TSB4.4(Y)  [also labelled ~OE54]
Y55: TSB11.1(~OE) TSB11.4(Y)  [also labelled ~OE55]
Y56: TSB18.1(~OE) TSB18.4(Y)  [also labelled ~OE56]
Y57: TSB25.1(~OE) TSB25.4(Y)  [also labelled ~OE57]
Y58: TSB32.1(~OE) TSB32.4(Y)  [also labelled ~OE58]
Y59: TSB39.1(~OE) TSB39.4(Y)  [also labelled ~OE59]
Y60: TSB46.1(~OE) TSB46.4(Y)  [also labelled ~OE60]
Y61: TSB53.1(~OE) TSB53.4(Y)  [also labelled ~OE61]
Y62: TSB60.1(~OE) TSB60.4(Y)  [also labelled ~OE62]
Y63: TSB67.1(~OE) TSB67.4(Y)  [also labelled ~OE63]
Y64: TSB74.4(Y)
Y65: TSB81.4(Y)
Y66: TSB88.4(Y)
Y67: TSB95.4(Y)
Y68: TSB102.4(Y)
Y69: TSB109.4(Y)
Y70: TSB116.4(Y)
Y71: TSB123.4(Y)
Y72: TSB5.4(Y)
Y73: TSB12.4(Y)
Y74: TSB19.4(Y)
Y75: TSB26.4(Y)
Y76: TSB33.4(Y)
Y77: TSB40.4(Y)
Y78: TSB47.4(Y)
Y79: TSB54.4(Y)
Y80: TSB61.4(Y)
Y81: TSB68.4(Y)
Y82: TSB75.4(Y)
Y83: TSB82.4(Y)
Y84: TSB89.4(Y)
Y85: TSB96.4(Y)
Y86: TSB103.4(Y)
Y87: TSB110.4(Y)
Y88: TSB117.4(Y)
Y89: TSB124.4(Y)
Y90: TSB6.4(Y)
Y91: TSB13.4(Y)
Y92: TSB20.4(Y)
Y93: TSB27.4(Y)
Y94: TSB34.4(Y)
Y95: TSB41.4(Y)
Y96: TSB48.4(Y)
Y97: TSB55.4(Y)
Y98: TSB62.4(Y)
Y99: TSB69.4(Y)
Y100: TSB76.4(Y)
Y101: TSB83.4(Y)
Y102: TSB90.4(Y)
Y103: TSB97.4(Y)
Y104: TSB104.4(Y)
Y105: TSB111.4(Y)
Y106: TSB118.4(Y)
Y107: TSB125.4(Y)
Y108: TSB7.4(Y)
Y109: TSB14.4(Y)
Y110: TSB21.4(Y)
Y111: TSB28.4(Y)
Y112: TSB35.4(Y)
Y113: TSB42.4(Y)
Y114: TSB49.4(Y)
Y115: TSB56.4(Y)
Y116: TSB63.4(Y)
Y117: TSB70.4(Y)
Y118: TSB77.4(Y)
Y119: TSB84.4(Y)
Y120: TSB91.4(Y)
Y121: TSB98.4(Y)
Y122: TSB105.4(Y)
Y123: TSB112.4(Y)
Y124: TSB119.4(Y)
Y125: TSB126.4(Y)
Y126: TSB127.4(Y)
Y127: TSB128.4(Y)
~OE0: TSB1.1(~OE)
~OE1: TSB8.1(~OE)
~OE2: TSB15.1(~OE)
~OE3: TSB22.1(~OE)
~OE4: TSB29.1(~OE)
~OE5: TSB36.1(~OE)
~OE6: TSB43.1(~OE)
~OE7: TSB50.1(~OE)
~OE8: TSB57.1(~OE)
~OE9: TSB64.1(~OE)
~OE10: TSB71.1(~OE)
~OE11: TSB78.1(~OE)
~OE12: TSB85.1(~OE)
~OE13: TSB92.1(~OE)
~OE14: TSB99.1(~OE)
~OE15: TSB106.1(~OE)
~OE16: TSB113.1(~OE)
~OE17: TSB120.1(~OE)
~OE18: TSB2.1(~OE)
~OE19: TSB9.1(~OE)
~OE20: TSB16.1(~OE)
~OE21: TSB23.1(~OE)
~OE22: TSB30.1(~OE)
~OE23: TSB37.1(~OE)
~OE24: TSB44.1(~OE)
~OE25: TSB51.1(~OE)
~OE26: TSB58.1(~OE)
~OE27: TSB65.1(~OE)
~OE28: TSB72.1(~OE)
~OE29: TSB79.1(~OE)
~OE30: TSB86.1(~OE)
~OE31: TSB93.1(~OE)
~OE32: TSB100.1(~OE)
~OE33: TSB107.1(~OE)
~OE34: TSB114.1(~OE)
~OE35: TSB121.1(~OE)
~OE36: TSB3.1(~OE)
~OE37: TSB10.1(~OE)
~OE38: TSB17.1(~OE)
~OE39: TSB24.1(~OE)
~OE40: TSB31.1(~OE)
~OE41: TSB38.1(~OE)
~OE42: TSB45.1(~OE)
~OE43: TSB52.1(~OE)
~OE44: TSB59.1(~OE)
~OE45: TSB66.1(~OE)
~OE46: TSB73.1(~OE)
~OE47: TSB80.1(~OE)
~OE64: TSB74.1(~OE)
~OE65: TSB81.1(~OE)
~OE66: TSB88.1(~OE)
~OE67: TSB95.1(~OE)
~OE68: TSB102.1(~OE)
~OE69: TSB109.1(~OE)
~OE70: TSB116.1(~OE)
~OE71: TSB123.1(~OE)
~OE72: TSB5.1(~OE)
~OE73: TSB12.1(~OE)
~OE74: TSB19.1(~OE)
~OE75: TSB26.1(~OE)
~OE76: TSB33.1(~OE)
~OE77: TSB40.1(~OE)
~OE78: TSB47.1(~OE)
~OE79: TSB54.1(~OE)
~OE80: TSB61.1(~OE)
~OE81: TSB68.1(~OE)
~OE82: TSB75.1(~OE)
~OE83: TSB82.1(~OE)
~OE84: TSB89.1(~OE)
~OE85: TSB96.1(~OE)
~OE86: TSB103.1(~OE)
~OE87: TSB110.1(~OE)
~OE88: TSB117.1(~OE)
~OE89: TSB124.1(~OE)
~OE90: TSB6.1(~OE)
~OE91: TSB13.1(~OE)
~OE92: TSB20.1(~OE)
~OE93: TSB27.1(~OE)
~OE94: TSB34.1(~OE)
~OE95: TSB41.1(~OE)
~OE96: TSB48.1(~OE)
~OE97: TSB55.1(~OE)
~OE98: TSB62.1(~OE)
~OE99: TSB69.1(~OE)
~OE100: TSB76.1(~OE)
~OE101: TSB83.1(~OE)
~OE102: TSB90.1(~OE)
~OE103: TSB97.1(~OE)
~OE104: TSB104.1(~OE)
~OE105: TSB111.1(~OE)
~OE106: TSB118.1(~OE)
~OE107: TSB125.1(~OE)
~OE108: TSB7.1(~OE)
~OE109: TSB14.1(~OE)
~OE110: TSB21.1(~OE)
~OE111: TSB28.1(~OE)
~OE112: TSB35.1(~OE)
~OE113: TSB42.1(~OE)
~OE114: TSB49.1(~OE)
~OE115: TSB56.1(~OE)
~OE116: TSB63.1(~OE)
~OE117: TSB70.1(~OE)
~OE118: TSB77.1(~OE)
~OE119: TSB84.1(~OE)
~OE120: TSB91.1(~OE)
~OE121: TSB98.1(~OE)
~OE122: TSB105.1(~OE)
~OE123: TSB112.1(~OE)
~OE124: TSB119.1(~OE)
~OE125: TSB126.1(~OE)
~OE126: TSB127.1(~OE)
~OE127: TSB128.1(~OE)

Not connected (* = marked no-connect by the designer): TSB120 5(Vcc); TSB121 5(Vcc); TSB122 3(GND) 5(Vcc); TSB123 5(Vcc); TSB124 5(Vcc); TSB125 5(Vcc); TSB127 5(Vcc); TSB128 5(Vcc)

## Buses and harness runs
bus A[15..0] = port A[15..0]
bus A[31..16] = port A[31..16]
bus A[47..32] = port A[47..32]
bus A[63..48] = port A[63..48]
bus A[79..64] = port A[79..64]
bus A[95..80] = port A[95..80]
bus A[111..96] = port A[111..96]
bus A[127..112] = port A[125..112]
bus Y[15..0] = port Y[15..0]
bus Y[31..16] = port Y[31..16]
bus Y[47..32] = port Y[47..32]
bus Y[63..48] = ~OE[63..48] = port Y[63..48] = port ~OE[63..48]
bus Y[79..64] = port Y[79..64]
bus Y[95..80] = port Y[95..80]
bus Y[111..96] = port Y[111..96]
bus Y[127..112] = port Y[127..112]
bus ~OE[15..0] = port ~OE[15..0]
bus ~OE[31..16] = port ~OE[31..16]
bus ~OE[47..32] = port ~OE[47..32]
bus ~OE[79..64] = port ~OE[79..64]
bus ~OE[95..80] = port ~OE[95..80]
bus ~OE[111..96] = port ~OE[111..96]
bus ~OE[127..112] = port ~OE[127..112]

## Library data of the parts
TSB1-TSB128 = Tri-State Buffer Non-Inverting: IC BUFF DVR TRI-ST N-INV 5TSSOP; Manufacturer: NXP Semiconductors; Manufacturer Part Number: 74LVC1G125GW,125; Logic Type: Buffer/Line Driver, Non-Inverting; Number of Elements: 1; Current - Output High, Low: 32mA, 32mA; Voltage - Supply: 1.65 V ~ 5.5 V; Supplier 1: Digi-Key; RoHS: RoHS Compliant; Category: Integrated Circuits (ICs); Stock 1: 56738; Pricing 1: 1=0.29, 10=0.235, 100=0.1244, 500=0.08184, 1000=0.05576 (USD); Packaging: Cut Tape (CT); Number of Bits per Element: 1; Operating Temperature: -40°C ~ 125°C; Mounting Type: Surface Mount; Package / Case: 5-TSSOP, SC-70-5, SOT-353; Supplier Device Package: 5-TSSOP; ComponentLink1URL: http://www.nxp.com/documents/data_sheet/74LVC1G125.pdf; ComponentLink1Description: http://www.nxp.com/documents/data_sheet/74LVC1G125.pdf; Supplier Part Number 1: 568-3005-1-ND